# EAGLE design internal_board_OBC_ADCS_ver5_1 (EAGLE 9.0.1)
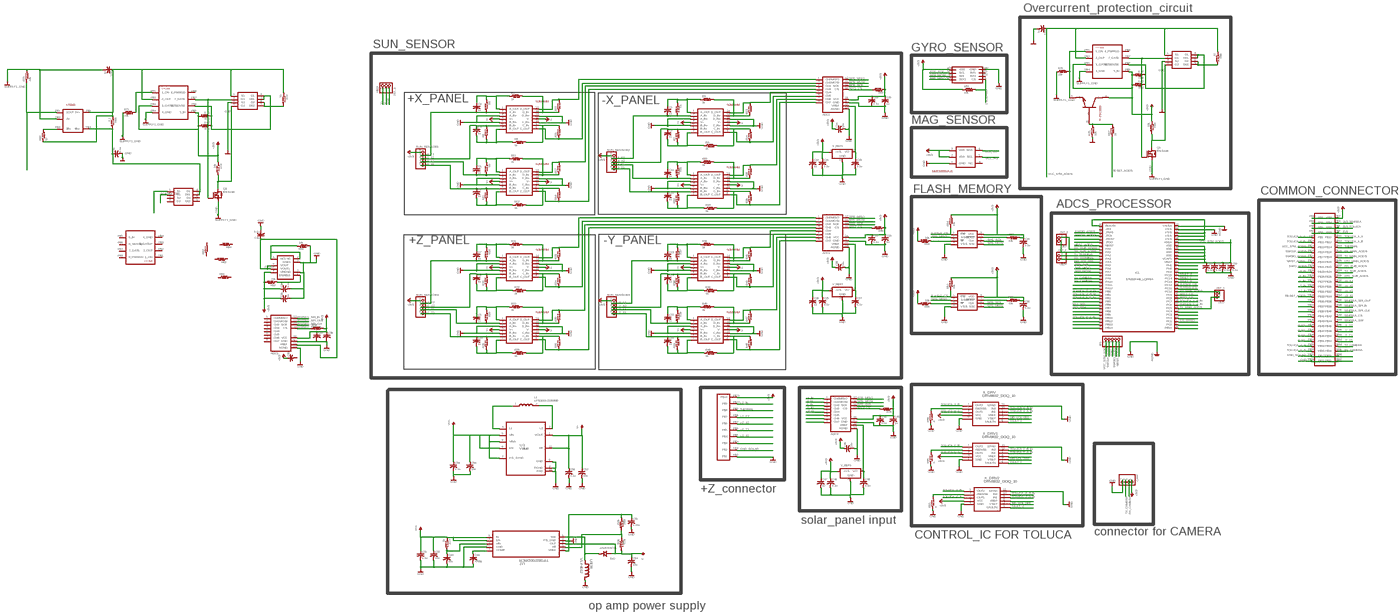
[diagram p0: schematic, sheet 1, overview]
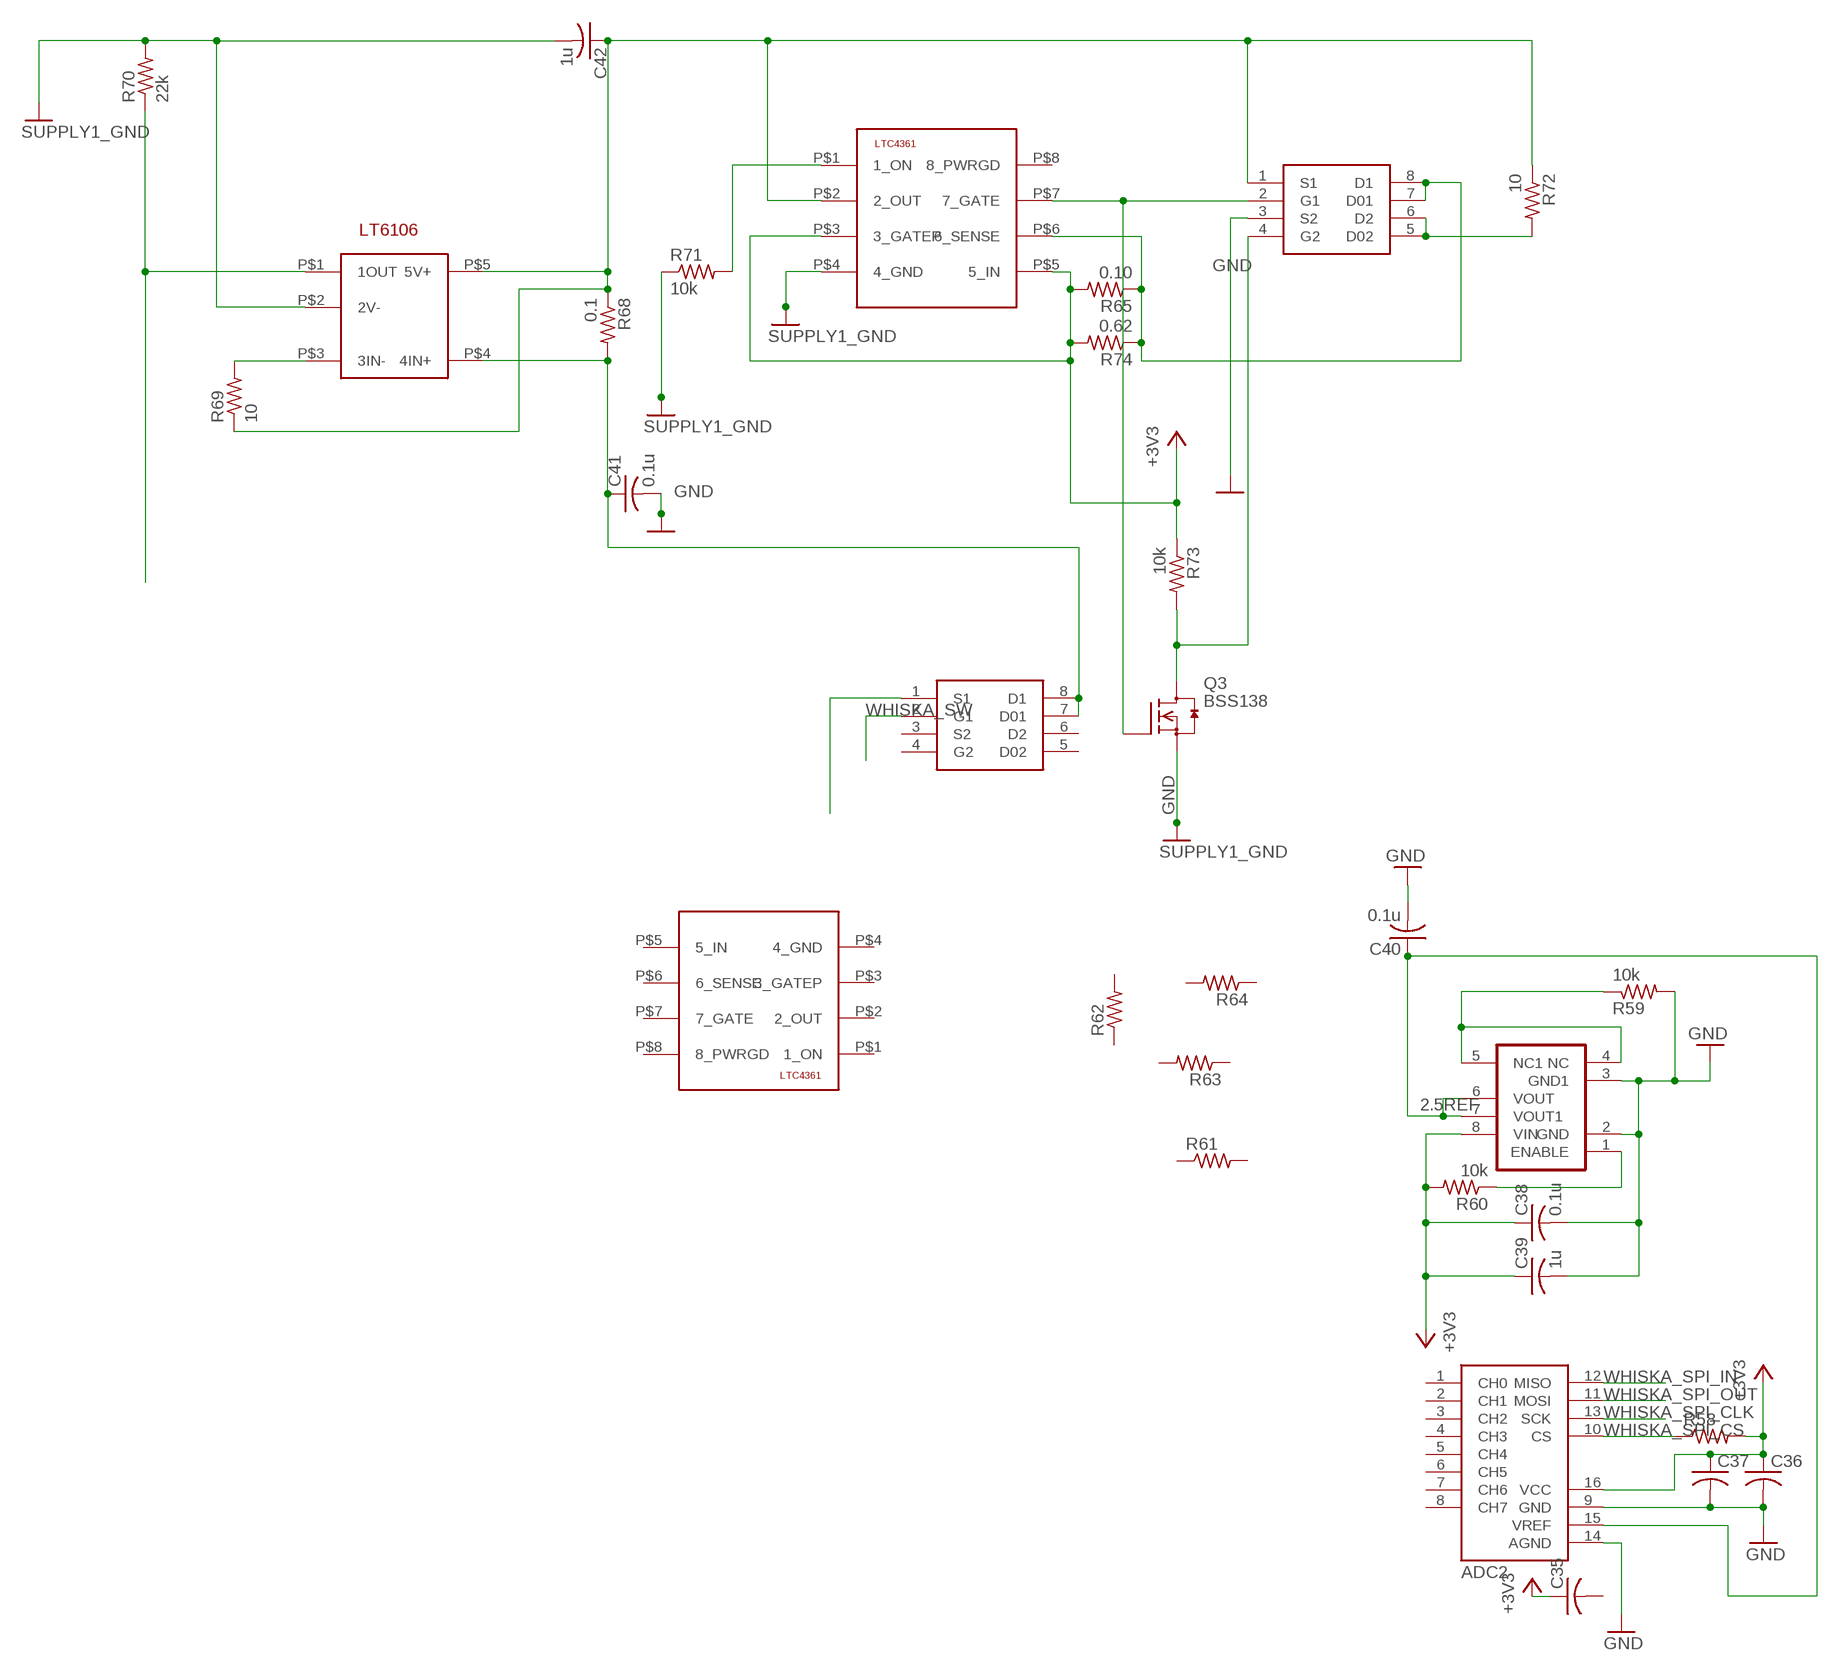
[diagram p1: schematic, sheet 1, part 1 of 4]
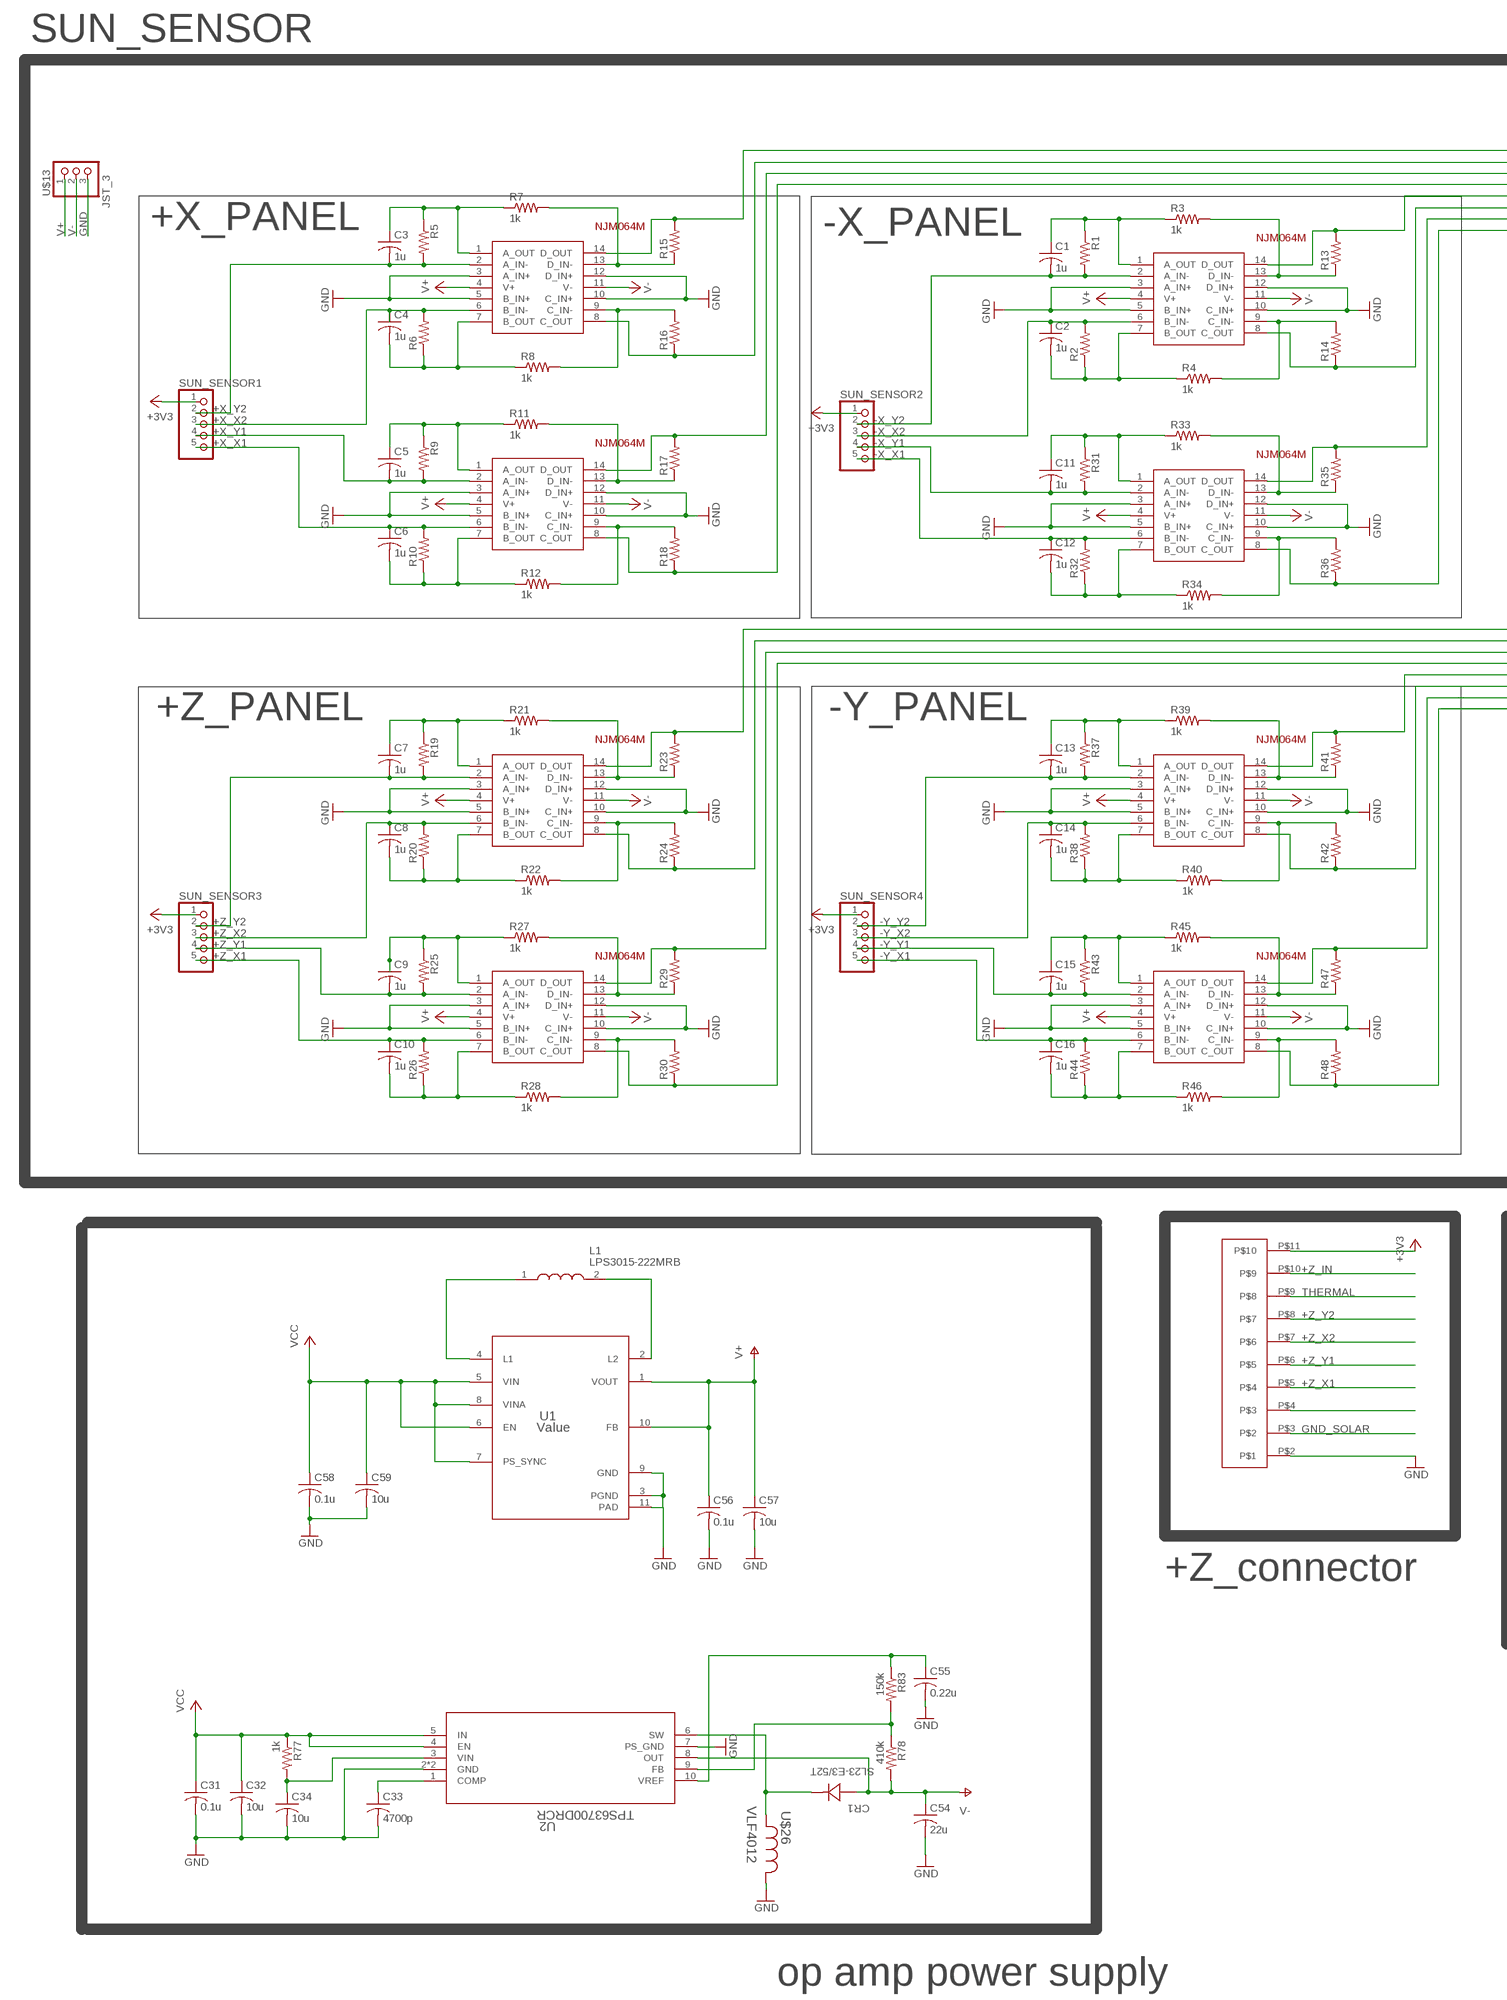
[diagram p2: schematic, sheet 1, part 2 of 4]
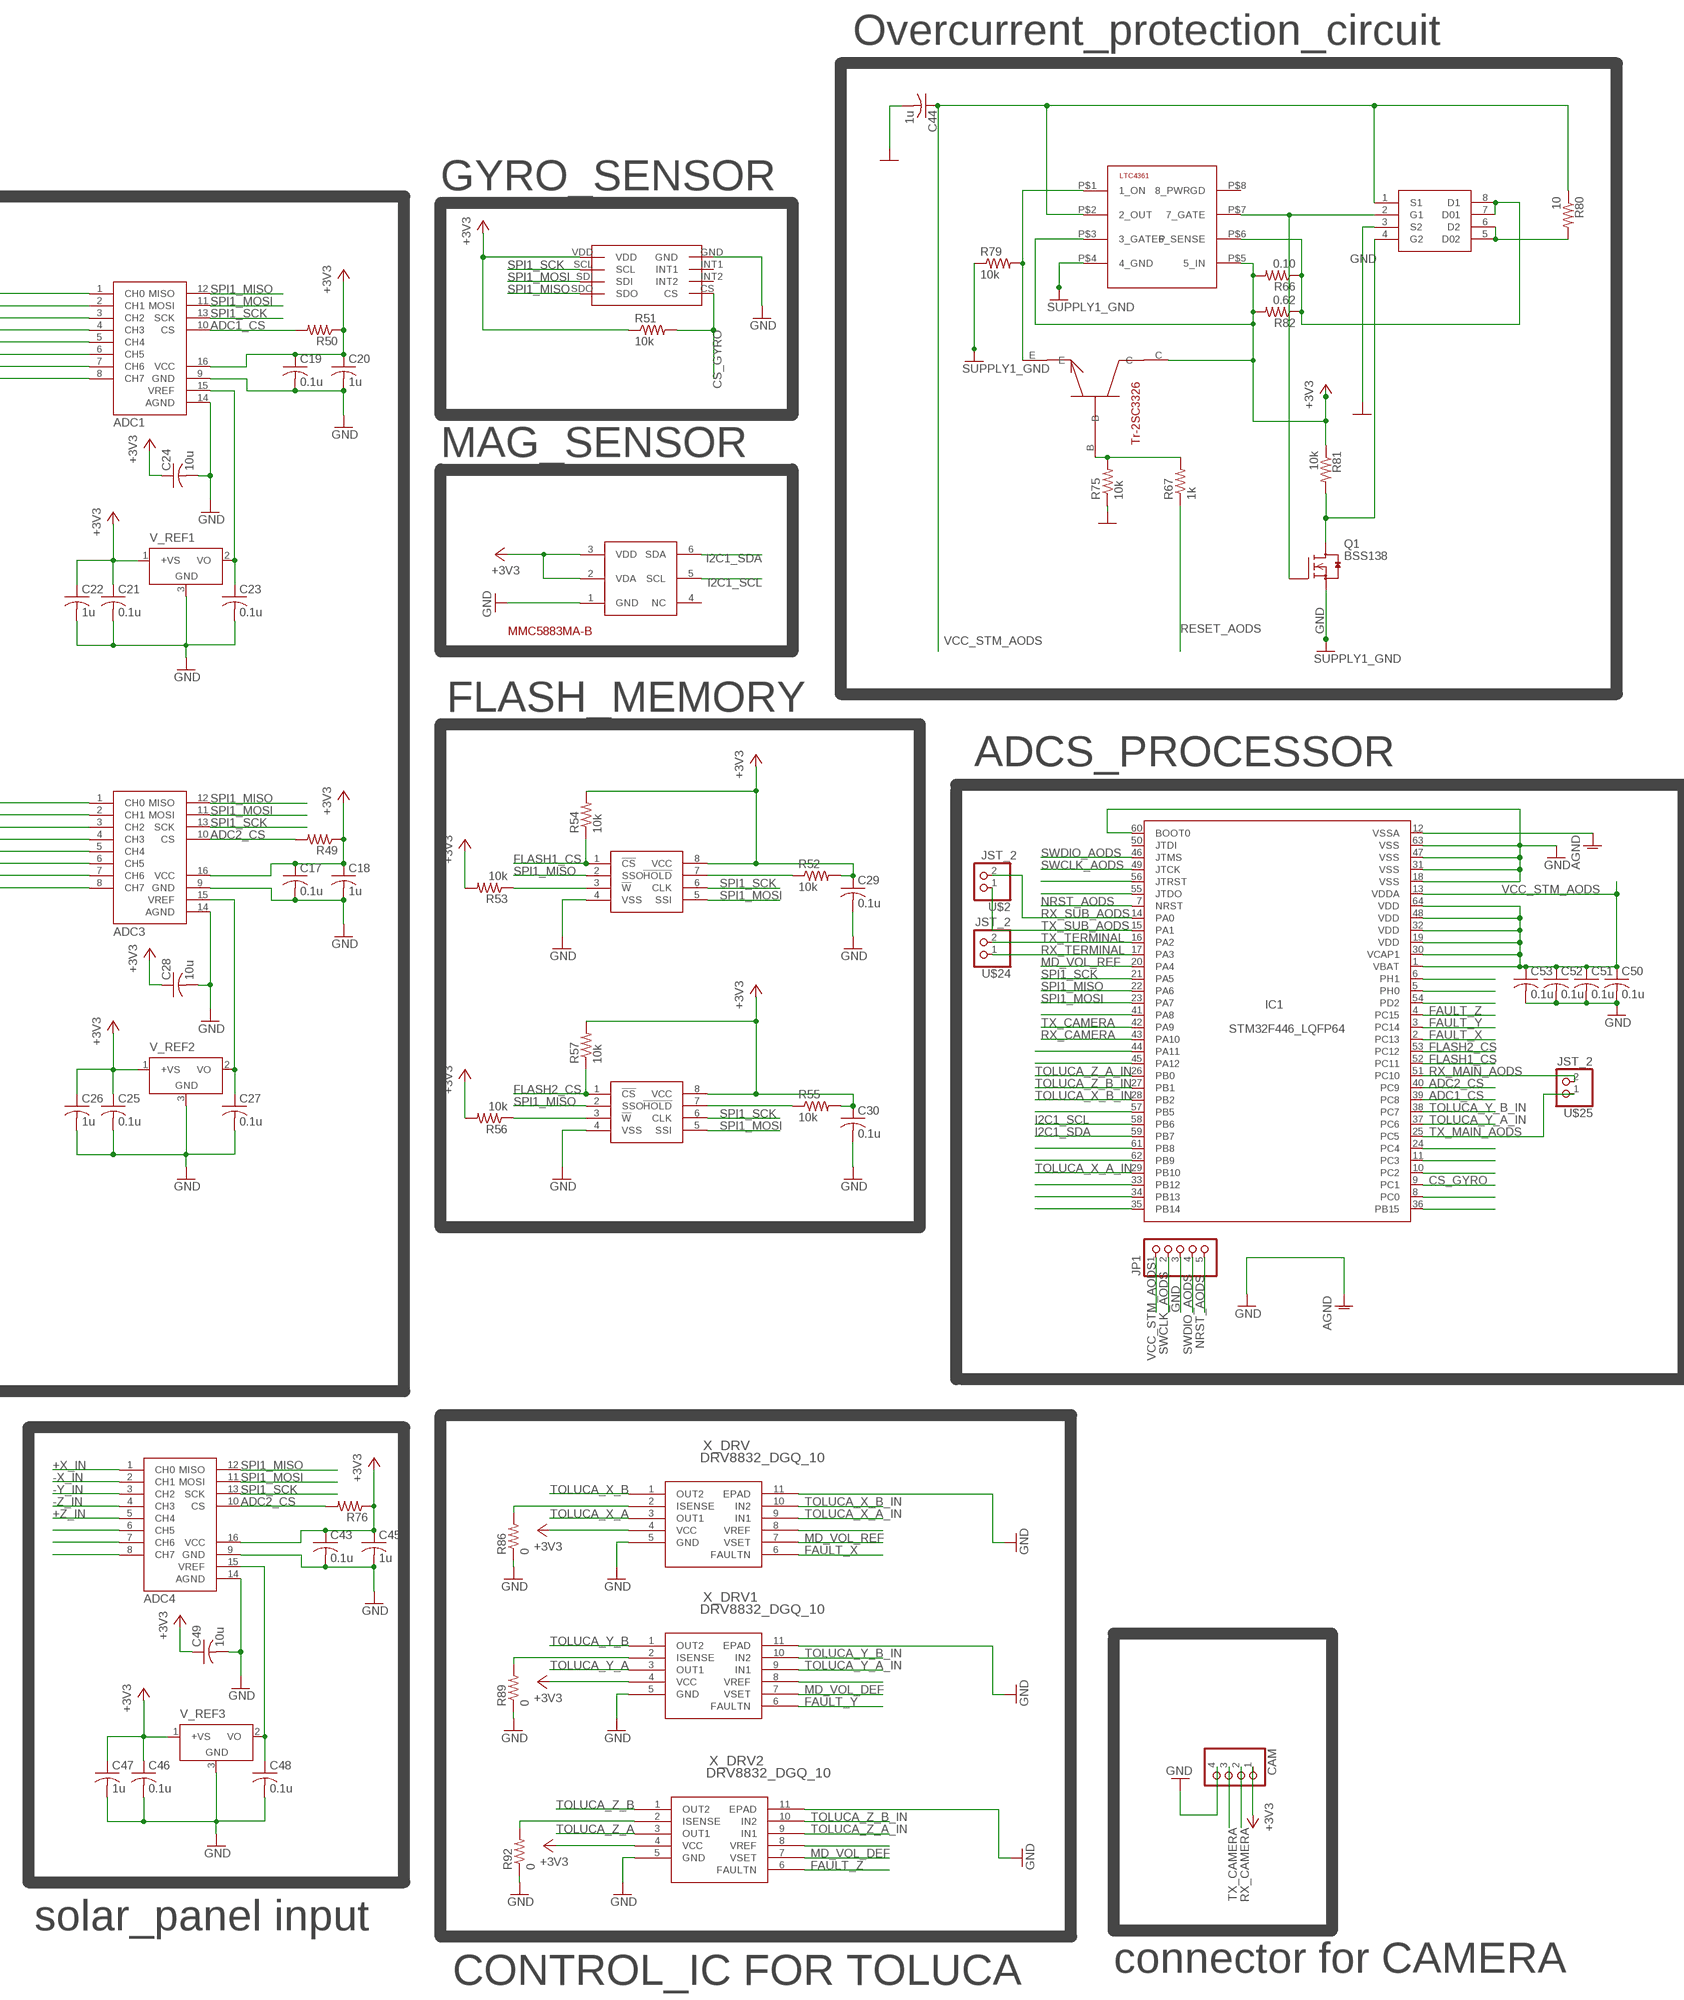
[diagram p3: schematic, sheet 1, part 3 of 4]
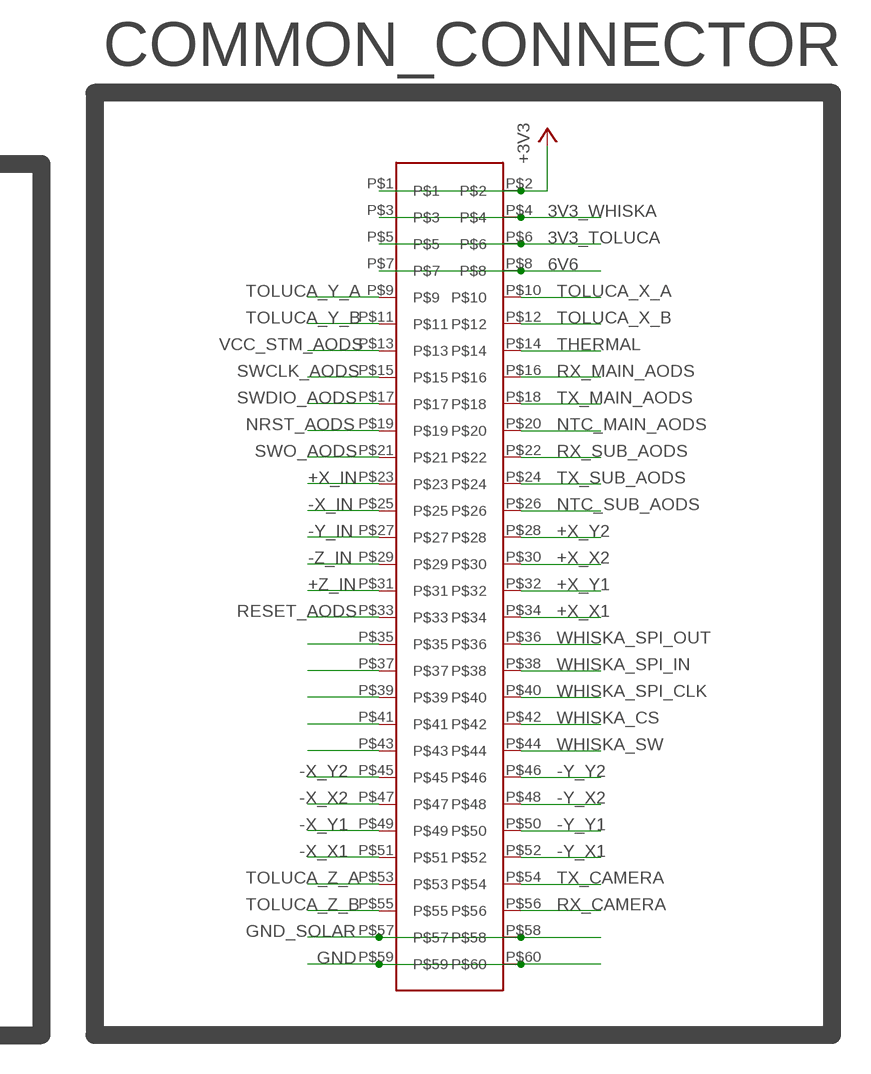
[diagram p4: schematic, sheet 1, part 4 of 4]

## Parts
ADC1  ADC_MCP3208  [SO16]
ADC2  ADC_MCP3208  [SO16]
ADC3  ADC_MCP3208  [SO16]
ADC4  ADC_MCP3208  [SO16]
C1  1u  C-USC2012  [C2012]
C2  1u  C-USC2012  [C2012]
C3  1u  C-USC2012  [C2012]
C4  1u  C-USC2012  [C2012]
C5  1u  C-USC2012  [C2012]
C6  1u  C-USC2012  [C2012]
C7  1u  C-USC2012  [C2012]
C8  1u  C-USC2012  [C2012]
C9  1u  C-USC2012  [C2012]
C10  1u  C-USC2012  [C2012]
C11  1u  C-USC2012  [C2012]
C12  1u  C-USC2012  [C2012]
C13  1u  C-USC2012  [C2012]
C14  1u  C-USC2012  [C2012]
C15  1u  C-USC2012  [C2012]
C16  1u  C-USC2012  [C2012]
C17  0.1u  C-USC2012  [C2012]
C18  1u  C-USC2012  [C2012]
C19  0.1u  C-USC2012  [C2012]
C20  1u  C-USC2012  [C2012]
C21  0.1u  C-USC2012  [C2012]
C22  1u  C-USC2012  [C2012]
C23  0.1u  C-USC2012  [C2012]
C24  10u  C-USC2012  [C2012]
C25  0.1u  C-USC2012  [C2012]
C26  1u  C-USC2012  [C2012]
C27  0.1u  C-USC2012  [C2012]
C28  10u  C-USC2012  [C2012]
C29  0.1u  C-USC2012  [C2012]
C30  0.1u  C-USC2012  [C2012]
C31  0.1u  C-USC2012  [C2012]
C32  10u  C-USC2012  [C2012]
C33  4700p  C-USC2012  [C2012]
C34  10u  C-USC2012  [C2012]
C35  C-USC2012  [C2012]
C36  C-USC2012  [C2012]
C37  C-USC2012  [C2012]
C38  0.1u  C-USC2012  [C2012]
C39  1u  C-USC2012  [C2012]
C40  0.1u  C-USC2012  [C2012]
C41  0.1u  C-USC2012  [C2012]
C42  1u  C-USC2012  [C2012]
C43  0.1u  C-USC2012  [C2012]
C44  1u  C-USC2012  [C2012]
C45  1u  C-USC2012  [C2012]
C46  0.1u  C-USC2012  [C2012]
C47  1u  C-USC2012  [C2012]
C48  0.1u  C-USC2012  [C2012]
C49  10u  C-USC2012  [C2012]
C50  0.1u  C-USC2012  [C2012]
C51  0.1u  C-USC2012  [C2012]
C52  0.1u  C-USC2012  [C2012]
C53  0.1u  C-USC2012  [C2012]
C54  22u  C-USC2012  [C2012]
C55  0.22u  C-USC2012  [C2012]
C56  0.1u  C-USC2012  [C2012]
C57  10u  C-USC2012  [C2012]
C58  0.1u  C-USC2012  [C2012]
C59  10u  C-USC2012  [C2012]
CAM  PINHD-1X4  [1X04]
CR1  SL23-E3/52T  [DIODE_DO214AA]
FLASH_CAM  MP25P80  [SO-08M]
FLASH_SENSOR  MP25P80  [SO-08M]
IC1  STM32F446_LQFP64  [LQFP64_PACKAGE]
JP1  PINHD-1X5  [1X05]
L1  LPS3015-222MRB  [LPS3015]
Q1  BSS138  [SOT23]
Q3  BSS138  [SOT23]
R1  R-US_R2012  [R2012]
R2  R-US_R2012  [R2012]
R3  1k  R-US_R2012  [R2012]
R4  1k  R-US_R2012  [R2012]
R5  R-US_R2012  [R2012]
R6  R-US_R2012  [R2012]
R7  1k  R-US_R2012  [R2012]
R8  1k  R-US_R2012  [R2012]
R9  R-US_R2012  [R2012]
R10  R-US_R2012  [R2012]
R11  1k  R-US_R2012  [R2012]
R12  1k  R-US_R2012  [R2012]
R13  R-US_R2012  [R2012]
R14  R-US_R2012  [R2012]
R15  R-US_R2012  [R2012]
R16  R-US_R2012  [R2012]
R17  R-US_R2012  [R2012]
R18  R-US_R2012  [R2012]
R19  R-US_R2012  [R2012]
R20  R-US_R2012  [R2012]
R21  1k  R-US_R2012  [R2012]
R22  1k  R-US_R2012  [R2012]
R23  R-US_R2012  [R2012]
R24  R-US_R2012  [R2012]
R25  R-US_R2012  [R2012]
R26  R-US_R2012  [R2012]
R27  1k  R-US_R2012  [R2012]
R28  1k  R-US_R2012  [R2012]
R29  R-US_R2012  [R2012]
R30  R-US_R2012  [R2012]
R31  R-US_R2012  [R2012]
R32  R-US_R2012  [R2012]
R33  1k  R-US_R2012  [R2012]
R34  1k  R-US_R2012  [R2012]
R35  R-US_R2012  [R2012]
R36  R-US_R2012  [R2012]
R37  R-US_R2012  [R2012]
R38  R-US_R2012  [R2012]
R39  1k  R-US_R2012  [R2012]
R40  1k  R-US_R2012  [R2012]
R41  R-US_R2012  [R2012]
R42  R-US_R2012  [R2012]
R43  R-US_R2012  [R2012]
R44  R-US_R2012  [R2012]
R45  1k  R-US_R2012  [R2012]
R46  1k  R-US_R2012  [R2012]
R47  R-US_R2012  [R2012]
R48  R-US_R2012  [R2012]
R49  R-US_R2012  [R2012]
R50  R-US_R2012  [R2012]
R51  10k  R-US_R2012  [R2012]
R52  10k  R-US_R2012  [R2012]
R53  10k  R-US_R2012  [R2012]
R54  10k  R-US_R2012  [R2012]
R55  10k  R-US_R2012  [R2012]
R56  10k  R-US_R2012  [R2012]
R57  10k  R-US_R2012  [R2012]
R58  R-US_R2012  [R2012]
R59  10k  R-US_R2012  [R2012]
R60  10k  R-US_R2012  [R2012]
R61  R-US_R2012  [R2012]
R62  R-US_R2012  [R2012]
R63  R-US_R2012  [R2012]
R64  R-US_R2012  [R2012]
R65  0.10  R-US_R2012  [R2012]
R66  0.10  R-US_R2012  [R2012]
R67  1k  R-US_R2012  [R2012]
R68  0.1  R-US_R2012  [R2012]
R69  10  R-US_R2012  [R2012]
R70  22k  R-US_R2012  [R2012]
R71  10k  R-US_R2012  [R2012]
R72  10  R-US_R2012  [R2012]
R73  10k  R-US_R2012  [R2012]
R74  0.62  R-US_R2012  [R2012]
R75  10k  R-US_R2012  [R2012]
R76  R-US_R2012  [R2012]
R77  1k  R-US_R2012  [R2012]
R78  410k  R-US_R2012  [R2012]
R79  10k  R-US_R2012  [R2012]
R80  10  R-US_R2012  [R2012]
R81  10k  R-US_R2012  [R2012]
R82  0.62  R-US_R2012  [R2012]
R83  150k  R-US_R2012  [R2012]
R86  0  R-US_R2012  [R2012]
R89  0  R-US_R2012  [R2012]
R92  0  R-US_R2012  [R2012]
SUN_SENSOR1  PINHD-1X5  [1X05]
SUN_SENSOR2  PINHD-1X5  [1X05]
SUN_SENSOR3  PINHD-1X5  [1X05]
SUN_SENSOR4  PINHD-1X5  [1X05]
U1  Value  TPS63000DRCR  [DRC0010A]
U2  TPS63700DRCR  [DRC10_2P4X1P65]
U$1  1.27_60  [1.27_60]
U$2  JST_2  [JST_2]
U$3  MMC5883MA-B  [MMC5883MA-B]
U$4  L3GD20_SET  [L3GD20_SET]
U$5  NJM064M  [NJM064M]
U$6  NJM064M  [NJM064M]
U$7  NJM064M  [NJM064M]
U$8  NJM064M  [NJM064M]
U$9  NJM064M  [NJM064M]
U$10  NJM064M  [NJM064M]
U$11  NJM064M  [NJM064M]
U$12  NJM064M  [NJM064M]
U$13  JST_3  [JST_3]
U$14  ADR3525  [ADR3525]
U$15  LTC4361  [LTC4361_2]
U$16  IRF7910  [SO-08]
U$17  LTC4361  [LTC4361_2]
U$18  LT6106  [LT6106]
U$19  IRF7910  [SO-08]
U$20  TR-NPN-2SC3326  [TR-NPN-2SC3326]
U$21  JST_1MM_10  [JST_1MM_10]
U$22  IRF7910  [SO-08]
U$23  LTC4361  [LTC4361_2]
U$24  JST_2  [JST_2]
U$25  JST_2  [JST_2]
U$26  VLF4012  [IND_4012]
V_REF1  LM50  [SOT23]
V_REF2  LM50  [SOT23]
V_REF3  LM50  [SOT23]
X_DRV  DRV8832_DGQ_10  [DGQ10_2P18X1P72]
X_DRV1  DRV8832_DGQ_10  [DGQ10_2P18X1P72]
X_DRV2  DRV8832_DGQ_10  [DGQ10_2P18X1P72]

## Nets
2.5REF: ADC2.15(VREF) C40.1 U$14.6(VOUT) U$14.7(VOUT1)
3V3_TOLUCA: U$1.P$5 U$1.P$6
3V3_WHISKA: U$1.P$3 U$1.P$4
6V6: U$1.P$7 U$1.P$8
+3V3: ADC1.16(VCC) ADC2.16(VCC) ADC3.16(VCC) ADC4.16(VCC) C17.1 C18.1 C19.1 C20.1 C21.1 C22.1 C24.1 C25.1 C26.1 C28.1 C29.1 C30.1 C35.1 C36.1 C37.1 C38.1 C39.1 C43.1 C45.1 C46.1 C47.1 C49.1 CAM.1 FLASH_CAM.8(VCC) FLASH_SENSOR.8(VCC) R49.1 R50.1 R51.1 R52.2 R53.2 R54.2 R55.2 R56.2 R57.2 R58.2 R60.2 R65.2 R66.2 R73.1 R74.2 R76.1 R81.1 R82.2 SUN_SENSOR1.1 SUN_SENSOR2.1 SUN_SENSOR3.1 SUN_SENSOR4.1 U$1.P$1 U$1.P$2 U$3.2(VDA) U$3.3(VDD) U$4.VDD U$14.8(VIN) U$15.P$3(3_GATEP) U$15.P$5(5_IN) U$17.P$3(3_GATEP) U$17.P$5(5_IN) U$20.C U$21.P$11 V_REF1.1(+VS) V_REF2.1(+VS) V_REF3.1(+VS) X_DRV1.4(VCC) X_DRV2.4(VCC) X_DRV.4(VCC)
+X_IN: ADC4.1(CH0) U$1.P$23
+X_X1: C6.1 R10.2 SUN_SENSOR1.5 U$1.P$34 U$7.6(B_IN-)
+X_X2: C4.1 R6.2 SUN_SENSOR1.3 U$1.P$30 U$6.6(B_IN-)
+X_Y1: C5.2 R9.2 SUN_SENSOR1.4 U$1.P$32 U$7.2(A_IN-)
+X_Y2: C3.2 R5.2 SUN_SENSOR1.2 U$1.P$28 U$6.2(A_IN-)
+Z_IN: ADC4.5(CH4) U$1.P$31 U$21.P$10
+Z_X1: C10.1 R26.2 SUN_SENSOR3.5 U$9.6(B_IN-) U$21.P$5
+Z_X2: C8.1 R20.2 SUN_SENSOR3.3 U$8.6(B_IN-) U$21.P$7
+Z_Y1: C9.2 R25.2 SUN_SENSOR3.4 U$9.2(A_IN-) U$21.P$6
+Z_Y2: C7.2 R19.2 SUN_SENSOR3.2 U$8.2(A_IN-) U$21.P$8
-X_IN: ADC4.2(CH1) U$1.P$25
-X_X1: C12.1 R32.2 SUN_SENSOR2.5 U$1.P$51 U$10.6(B_IN-)
-X_X2: C2.1 R2.2 SUN_SENSOR2.3 U$1.P$47 U$5.6(B_IN-)
-X_Y1: C11.2 R31.2 SUN_SENSOR2.4 U$1.P$49 U$10.2(A_IN-)
-X_Y2: C1.2 R1.2 SUN_SENSOR2.2 U$1.P$45 U$5.2(A_IN-)
-Y_IN: ADC4.3(CH2) U$1.P$27
-Y_X1: C16.1 R44.2 SUN_SENSOR4.5 U$1.P$52 U$12.6(B_IN-)
-Y_X2: C14.1 R38.2 SUN_SENSOR4.3 U$1.P$48 U$11.6(B_IN-)
-Y_Y1: C15.2 R43.2 SUN_SENSOR4.4 U$1.P$50 U$12.2(A_IN-)
-Y_Y2: C13.2 R37.2 SUN_SENSOR4.2 U$1.P$46 U$11.2(A_IN-)
-Z_IN: ADC4.4(CH3) U$1.P$29
ADC1_CS: ADC1.10(CS) IC1.39(PC8) R50.2
ADC2_CS: ADC3.10(CS) ADC4.10(CS) IC1.40(PC9) R49.2 R76.2
AGND: IC1.12(VSSA)
CRT-18F: R70.1 U$18.P$1(1OUT)
CS_GYRO: IC1.9(PC1) R51.2 U$4.CS
FAULT_X: IC1.2(PC13) X_DRV.6(FAULTN)
FAULT_Y: IC1.3(PC14) X_DRV1.6(FAULTN)
FAULT_Z: IC1.4(PC15) X_DRV2.6(FAULTN)
FLASH1_CS: FLASH_SENSOR.1(!CS) IC1.52(PC11) R54.1
FLASH2_CS: FLASH_CAM.1(!CS) IC1.53(PC12) R57.1
GND: ADC1.9(GND) ADC1.14(AGND) ADC2.9(GND) ADC2.14(AGND) ADC3.9(GND) ADC3.14(AGND) ADC4.9(GND) ADC4.14(AGND) C17.2 C18.2 C19.2 C20.2 C21.2 C22.2 C23.2 C24.2 C25.2 C26.2 C27.2 C28.2 C29.2 C30.2 C31.2 C32.2 C33.2 C34.2 C36.2 C37.2 C38.2 C39.2 C40.2 C41.2 C42.2 C43.2 C44.2 C45.2 C46.2 C47.2 C48.2 C49.2 C50.2 C51.2 C52.2 C53.2 C54.2 C55.2 C56.2 C57.2 C58.2 C59.2 CAM.4 FLASH_CAM.4(VSS) FLASH_SENSOR.4(VSS) IC1.18(VSS) IC1.31(VSS) IC1.47(VSS) IC1.60(BOOT0) IC1.63(VSS) JP1.3 Q1.2(S) Q3.2(S) R59.2 R70.2 R71.1 R75.1 R79.1 R86.1 R89.1 R92.1 U1.3(PGND) U1.9(GND) U1.11(PAD) U2.2(GND) U2.7(PS_GND) U2.11(GND) U$1.P$59 U$1.P$60 U$3.1(GND) U$4.GND U$5.3(A_IN+) U$5.5(B_IN+) U$5.10(C_IN+) U$5.12(D_IN+) U$6.3(A_IN+) U$6.5(B_IN+) U$6.10(C_IN+) U$6.12(D_IN+) U$7.3(A_IN+) U$7.5(B_IN+) U$7.10(C_IN+) U$7.12(D_IN+) U$8.3(A_IN+) U$8.5(B_IN+) U$8.10(C_IN+) U$8.12(D_IN+) U$9.3(A_IN+) U$9.5(B_IN+) U$9.10(C_IN+) U$9.12(D_IN+) U$10.3(A_IN+) U$10.5(B_IN+) U$10.10(C_IN+) U$10.12(D_IN+) U$11.3(A_IN+) U$11.5(B_IN+) U$11.10(C_IN+) U$11.12(D_IN+) U$12.3(A_IN+) U$12.5(B_IN+) U$12.10(C_IN+) U$12.12(D_IN+) U$13.3 U$14.2(GND) U$14.3(GND1) U$15.P$4(4_GND) U$16.3(S2) U$17.P$4(4_GND) U$18.P$2(2V-) U$19.3(S2) U$21.P$2 U$26.1 V_REF1.3(GND) V_REF2.3(GND) V_REF3.3(GND) X_DRV1.5(GND) X_DRV1.11(EPAD) X_DRV2.5(GND) X_DRV2.11(EPAD) X_DRV.5(GND) X_DRV.11(EPAD) ; supply symbol labelled AGND, SUPPLY1_GND
GND_SOLAR: U$1.P$57 U$1.P$58 U$21.P$3
I2C1_SCL: IC1.58(PB6) U$3.5(SCL)
I2C1_SDA: IC1.59(PB7) U$3.6(SDA)
MD_VOL_DEF: X_DRV1.7(VSET) X_DRV2.7(VSET)
MD_VOL_REF: IC1.20(PA4) X_DRV.7(VSET)
N$1: C4.2 R6.1 R8.1 U$6.7(B_OUT)
N$2: ADC1.1(CH0) R15.2 U$6.14(D_OUT)
N$3: ADC1.2(CH1) R16.1 U$6.8(C_OUT)
N$4: ADC1.6(CH5) R14.1 U$5.8(C_OUT)
N$5: R8.2 R16.2 U$6.9(C_IN-)
N$6: ADC1.7(CH6) R35.2 U$10.14(D_OUT)
N$7: ADC1.8(CH7) R36.1 U$10.8(C_OUT)
N$8: ADC1.5(CH4) R13.2 U$5.14(D_OUT)
N$9: ADC3.1(CH0) R23.2 U$8.14(D_OUT)
N$10: C2.2 R2.1 R4.1 U$5.7(B_OUT)
N$11: R4.2 R14.2 U$5.9(C_IN-)
N$12: C8.2 R20.1 R22.1 U$8.7(B_OUT)
N$13: C1.1 R1.1 R3.1 U$5.1(A_OUT)
N$14: R3.2 R13.1 U$5.13(D_IN-)
N$15: C33.1 U2.1(COMP)
N$16: C3.1 R5.1 R7.1 U$6.1(A_OUT)
N$17: R7.2 R15.1 U$6.13(D_IN-)
N$18: IC1.56(JTRST)
N$19: IC1.55(JTDO)
N$20: U$21.P$4
N$21: C6.2 R10.1 R12.1 U$7.7(B_OUT)
N$22: R12.2 R18.2 U$7.9(C_IN-)
N$23: C5.1 R9.1 R11.1 U$7.1(A_OUT)
N$24: R11.2 R17.1 U$7.13(D_IN-)
N$25: U$22.1(S1)
N$26: IC1.41(PA8)
N$27: ADC1.15(VREF) C23.1 V_REF1.2(VO)
N$28: ADC1.4(CH3) R18.1 U$7.8(C_OUT)
N$29: C12.2 R32.1 R34.1 U$10.7(B_OUT)
N$30: ADC1.3(CH2) R17.2 U$7.14(D_OUT)
N$31: R22.2 R24.2 U$8.9(C_IN-)
N$32: C7.1 R19.1 R21.1 U$8.1(A_OUT)
N$33: R21.2 R23.1 U$8.13(D_IN-)
N$34: IC1.44(PA11)
N$35: IC1.45(PA12)
N$36: C10.2 R26.1 R28.1 U$9.7(B_OUT)
N$37: R28.2 R30.2 U$9.9(C_IN-)
N$38: C9.1 R25.1 R27.1 U$9.1(A_OUT)
N$39: R27.2 R29.1 U$9.13(D_IN-)
N$40: C55.1 R83.1 U2.10(VREF)
N$41: C34.1 R77.2 U2.3(VIN)
N$42: ADC3.3(CH2) R29.2 U$9.14(D_OUT)
N$43: ADC3.4(CH3) R30.1 U$9.8(C_OUT)
N$45: ADC3.2(CH1) R24.1 U$8.8(C_OUT)
N$46: R34.2 R36.2 U$10.9(C_IN-)
N$47: C11.1 R31.1 R33.1 U$10.1(A_OUT)
N$48: R33.2 R35.1 U$10.13(D_IN-)
N$49: ADC4.6(CH5)
N$50: ADC4.7(CH6)
N$51: X_DRV.8(VREF)
N$52: ADC3.15(VREF) C27.1 V_REF2.2(VO)
N$53: ADC3.5(CH4) R41.2 U$11.14(D_OUT)
N$54: ADC3.6(CH5) R42.1 U$11.8(C_OUT)
N$55: C14.2 R38.1 R40.1 U$11.7(B_OUT)
N$56: R40.2 R42.2 U$11.9(C_IN-)
N$57: C13.1 R37.1 R39.1 U$11.1(A_OUT)
N$58: R39.2 R41.1 U$11.13(D_IN-)
N$59: ADC4.8(CH7)
N$60: ADC4.15(VREF) C48.1 V_REF3.2(VO)
N$61: C16.2 R44.1 R46.1 U$12.7(B_OUT)
N$62: R46.2 R48.2 U$12.9(C_IN-)
N$63: C15.1 R43.1 R45.1 U$12.1(A_OUT)
N$64: R45.2 R47.1 U$12.13(D_IN-)
N$65: R78.1 R83.2 U2.9(FB)
N$66: CR1.1 U2.6(SW) U$26.2
N$67: ADC3.7(CH6) R47.2 U$12.14(D_OUT)
N$68: ADC3.8(CH7) R48.1 U$12.8(C_OUT)
N$69: R65.1 R74.1 U$15.P$6(6_SENSE) U$16.7(D01) U$16.8(D1)
N$70: FLASH_SENSOR.3(!W) R53.1
N$71: FLASH_CAM.7(!HOLD) R55.1
N$72: Q3.1(G) U$15.P$7(7_GATE) U$16.2(G1)
N$73: FLASH_CAM.3(!W) R56.1
N$74: FLASH_SENSOR.7(!HOLD) R52.1
N$75: C42.1 R68.1 R69.1 R72.1 U$15.P$2(2_OUT) U$16.1(S1) U$18.P$5(5V+)
N$76: IC1.5(PH0)
N$77: IC1.6(PH1)
N$78: R89.2 X_DRV1.2(ISENSE)
N$80: L1.1 U1.4(L1)
N$81: L1.2 U1.2(L2)
N$82: X_DRV2.8(VREF)
N$83: IC1.10(PC2)
N$84: IC1.11(PC3)
N$85: IC1.24(PC4)
N$86: R59.1 U$14.4(NC) U$14.5(NC1)
N$87: R60.1 U$14.1(ENABLE)
N$88: IC1.8(PC0)
N$89: IC1.36(PB15)
N$90: IC1.33(PB12)
N$91: R71.2 U$15.P$1(1_ON)
N$92: C41.1 R68.2 U$18.P$4(4IN+) U$22.7(D01) U$22.8(D1)
N$93: R69.2 U$18.P$3(3IN-)
N$94: R72.2 U$16.5(D02) U$16.6(D2)
N$95: Q3.3(D) R73.2 U$16.4(G2)
N$96: R66.1 R82.1 U$17.P$6(6_SENSE) U$19.7(D01) U$19.8(D1)
N$97: Q1.1(G) U$17.P$7(7_GATE) U$19.2(G1)
N$98: IC1.34(PB13)
N$99: R79.2 U$17.P$1(1_ON) U$20.E
N$100: R67.2 R75.2 U$20.B
N$101: IC1.35(PB14)
N$102: R80.2 U$19.5(D02) U$19.6(D2)
N$103: Q1.3(D) R81.2 U$19.4(G2)
N$104: IC1.54(PD2)
N$105: IC1.57(PB5)
N$106: U$1.P$35
N$107: U$1.P$37
N$108: U$1.P$39
N$109: U$1.P$41
N$110: U$1.P$43
N$111: IC1.61(PB8)
N$112: IC1.62(PB9)
N$113: R92.2 X_DRV2.2(ISENSE)
N$115: X_DRV1.8(VREF)
N$118: R86.2 X_DRV.2(ISENSE)
NRST_AODS: IC1.7(NRST) JP1.5 U$1.P$19
NTC_MAIN_AODS: U$1.P$20
NTC_SUB_AODS: U$1.P$26
RESET_AODS: R67.1 U$1.P$33
RX_CAMERA: CAM.2 IC1.43(PA10) U$1.P$56
RX_MAIN_AODS: IC1.51(PC10) U$1.P$16 U$25.2
RX_SUB_AODS: IC1.14(PA0) U$1.P$22 U$2.2
RX_TERMINAL: IC1.17(PA3) U$24.1
SPI1_MISO: ADC1.12(MISO) ADC3.12(MISO) ADC4.12(MISO) FLASH_CAM.2(SSO) FLASH_SENSOR.2(SSO) IC1.22(PA6) U$4.SDO
SPI1_MOSI: ADC1.11(MOSI) ADC3.11(MOSI) ADC4.11(MOSI) FLASH_CAM.5(SSI) FLASH_SENSOR.5(SSI) IC1.23(PA7) U$4.SDI
SPI1_SCK: ADC1.13(SCK) ADC3.13(SCK) ADC4.13(SCK) FLASH_CAM.6(CLK) FLASH_SENSOR.6(CLK) IC1.21(PA5) U$4.SCL
SWCLK_AODS: IC1.49(JTCK) JP1.2 U$1.P$15
SWDIO_AODS: IC1.46(JTMS) JP1.4 U$1.P$17
SWO_AODS: U$1.P$21
THERMAL: U$1.P$14 U$21.P$9
TOLUCA_X_A: U$1.P$10 X_DRV.3(OUT1)
TOLUCA_X_A_IN: IC1.29(PB10) X_DRV.9(IN1)
TOLUCA_X_B: U$1.P$12 X_DRV.1(OUT2)
TOLUCA_X_B_IN: IC1.28(PB2) X_DRV.10(IN2)
TOLUCA_Y_A: U$1.P$9 X_DRV1.3(OUT1)
TOLUCA_Y_A_IN: IC1.37(PC6) X_DRV1.9(IN1)
TOLUCA_Y_B: U$1.P$11 X_DRV1.1(OUT2)
TOLUCA_Y_B_IN: IC1.38(PC7) X_DRV1.10(IN2)
TOLUCA_Z_A: U$1.P$53 X_DRV2.3(OUT1)
TOLUCA_Z_A_IN: IC1.26(PB0) X_DRV2.9(IN1)
TOLUCA_Z_B: U$1.P$55 X_DRV2.1(OUT2)
TOLUCA_Z_B_IN: IC1.27(PB1) X_DRV2.10(IN2)
TX_CAMERA: CAM.3 IC1.42(PA9) U$1.P$54
TX_MAIN_AODS: IC1.25(PC5) U$1.P$18 U$25.1
TX_SUB_AODS: IC1.15(PA1) U$1.P$24 U$2.1
TX_TERMINAL: IC1.16(PA2) U$24.2
V+: C56.1 C57.1 U1.1(VOUT) U1.10(FB) U$5.4(V+) U$6.4(V+) U$7.4(V+) U$8.4(V+) U$9.4(V+) U$10.4(V+) U$11.4(V+) U$12.4(V+) U$13.1
V-: C54.1 CR1.2 R78.2 U2.8(OUT) U$5.11(V-) U$6.11(V-) U$7.11(V-) U$8.11(V-) U$9.11(V-) U$10.11(V-) U$11.11(V-) U$12.11(V-) U$13.2
VCC: C31.1 C32.1 C58.1 C59.1 R77.1 U1.5(VIN) U1.6(EN) U1.7(PS_SYNC) U1.8(VINA) U2.4(EN) U2.5(IN)
VCC_STM_AODS: C44.1 C50.1 C51.1 C52.1 C53.1 IC1.1(VBAT) IC1.13(VDDA) IC1.19(VDD) IC1.30(VCAP1) IC1.32(VDD) IC1.48(VDD) IC1.64(VDD) JP1.1 R80.1 U$1.P$13 U$17.P$2(2_OUT) U$19.1(S1)
WHISKA_CS: U$1.P$42
WHISKA_SPI_CLK: ADC2.13(SCK) U$1.P$40
WHISKA_SPI_CS: ADC2.10(CS) R58.1
WHISKA_SPI_IN: ADC2.12(MISO) U$1.P$38
WHISKA_SPI_OUT: ADC2.11(MOSI) U$1.P$36
WHISKA_SW: U$1.P$44 U$22.2(G1)
Unconnected: ADC2.1(CH0) ADC2.2(CH1) ADC2.3(CH2) ADC2.4(CH3) ADC2.5(CH4) ADC2.6(CH5) ADC2.7(CH6) ADC2.8(CH7) C35.2 IC1.50(JTDI) R61.1 R61.2 R62.1 R62.2 R63.1 R63.2 R64.1 R64.2 U$3.4(NC) U$4.INT1 U$4.INT2 U$15.P$8(8_PWRGD) U$17.P$8(8_PWRGD) U$22.3(S2) U$22.5(D02) U$22.6(D2) U$23.P$1(1_ON) U$23.P$2(2_OUT) U$23.P$3(3_GATEP) U$23.P$4(4_GND) U$23.P$5(5_IN) U$23.P$6(6_SENSE) U$23.P$7(7_GATE) U$23.P$8(8_PWRGD)

## Notes on the sheet
- Overcurrent_protection_circuit
- SUN_SENSOR | GYRO_SENSOR
- +X_PANEL | -X_PANEL
- MAG_SENSOR
- FLASH_MEMORY | COMMON_CONNECTOR
- ADCS_PROCESSOR
- +Z_PANEL | -Y_PANEL
- +Z_connector
- solar_panel input
- CONTROL_IC FOR TOLUCA | connector for CAMERA
- op amp power supply

## Power pins joined to a net without a drawn wire
G2: U$22.4(G2)

## Library data of the parts
ADC1-ADC4 = aoba01:ADC_MCP3208: MicroChip 12bit 8ch A/D converter
C1-C37 C43 C45-C59 = rcl:C-US: CAPACITOR, American symbol; SPICEPREFIX: C
C38-C42 C44 = resistor:C-US: CAPACITOR, American symbol
CAM = pinhead:PINHD-1X4: PIN HEADER
CR1 = SL23-E3:SL23-E3/52T; MANUFACTURER_PART_NUMBER: SL23E352T; VENDOR: Vishay
FLASH_CAM FLASH_SENSOR = aoba01:MP25P80: flashmemory
IC1 = stm32f446re:STM32F446_LQFP64: STM32F446_LQFP64 edit this description Auto generated by make-symbol-device-package-bsdl.ulp Rev. 44 Source: STM32F446_LQFP64.bsd
JP1 SUN_SENSOR1-SUN_SENSOR4 = pinhead:PINHD-1X5: PIN HEADER
L1 = SamacSys_Parts:LPS3015-222MRB: COILCRAFT - LPS3015-222MRB - INDUCTOR, SHLD, 2.2UH, 20%, 1.1A, SMD Source: Datasheet <https://componentsearchengine.com/Datasheets/1/LPS3015-222MRB.pdf>; DESCRIPTION: COILCRAFT - LPS3015-222MRB - INDUCTOR, SHLD, 2.2UH, 20%, 1.1A, SMD; HEIGHT: mm; MANUFACTURER_NAME: COILCRAFT; MANUFACTURER_PART_NUMBER: LPS3015-222MRB; MOUSER_PART_NUMBER: 994-LPS3015-222MRB; MOUSER_PRICE-STOCK: https://www.mouser.com/Search/Refine.aspx?Keyword=994-LPS3015-222MRB
Q1 Q3 = m-pad-2.1:BSS138: Fairchild Semiconductors BSS138 N-Channel Logic Level Enhancement Mode Field Effect Transistor General Description: These N-Channel enhancement mode field effect transistors are produced using Fairchild's proprietary, high cell density, DMOS technology. These products have been designed to minimize on-state resistance while provide rugged, reliable, and fast switching performance.These products are particularly suited for low voltage, low current applications such as small servo motor control, power MOSFET gate drivers, and other switching applications. Features: 0.22 A, 50 V. RDS(ON) = 3.5Ohm @ VGS = 10 V RDS(ON) = 6.0Ohm @ VGS = 4.5 V High density cell design for extremely low RDS(ON) Rugged and Reliable Compact industry standard SOT-23 surface mount package Please send any comments to: messi@users.sourceforge.net
R1-R58 R61-R64 R76-R78 R83 R86 R89 R92 = rcl:R-US_: RESISTOR, American symbol; SPICEPREFIX: R
R59 R60 R65-R75 R79-R82 = resistor:R-US_: RESISTOR, American symbol
U1 = TPS63000:TPS63000DRCR; COMPTYPE: IC; MANUFACTURER: Texas Instruments; MOUNTTYPE: SMT; PACKAGEREFERENCE: DRC0010A; PARTNUMBER: TPS63000DRC; PIN_COUNT: 11; REFDES: RefDes; ROHS: Y; TYPE: TYPE
U2 = TPS63700:TPS63700DRCR; MANUFACTURER_PART_NUMBER: TPS63700DRCR; VENDOR: Texas Instruments
U$1 = 1.27_2_60_pinhead:1.27_60
U$2 U$24 U$25 = JST01:JST_2
U$3 = MMC5883MA-B:MMC5883MA-B
U$4 = L3GD20_set:L3GD20_SET
U$5-U$12 = NJM064M:NJM064M
U$13 = JST01:JST_3
U$14 = aoba:ADR3525
U$15 U$17 U$23 = aoba:LTC4361
U$16 U$19 U$22 = aoba:IRF7910
U$18 = aoba:LT6106
U$20 = Kill-Sw:TR-NPN-2SC3326
U$21 = JST_1mm_5:JST_1MM_10
U$26 = VLF4012:VLF4012
V_REF1-V_REF3 = linear:LM50: SOT-23 Single-Supply Centigrade Temperature Sensor Vout = (10mV/°C x Temp °C) +5mmmV Source: http://cache.national.com/ds/LM/LM50.pdf
X_DRV X_DRV1 X_DRV2 = DRV8832_DGQ_10:DRV8832_DGQ_10; DATASHEETURL: httpwww.ti.comlitgpnDRV8832; FAMILY_NAME: BRUSHED DC DRIVER; GENERIC_PART_NUMBER: DRV8832; INDUSTRY_STD_PKG_TYPE: MSOPPowerPAD; MANUFACTURER: Texas Instruments; MANUFACTURER_PART_NUMBER: drv8832_dgq_10; PACKAGE_DESIGNATOR: DGQ; PIN_COUNT: 10; VENDOR: Texas Instruments

## Board
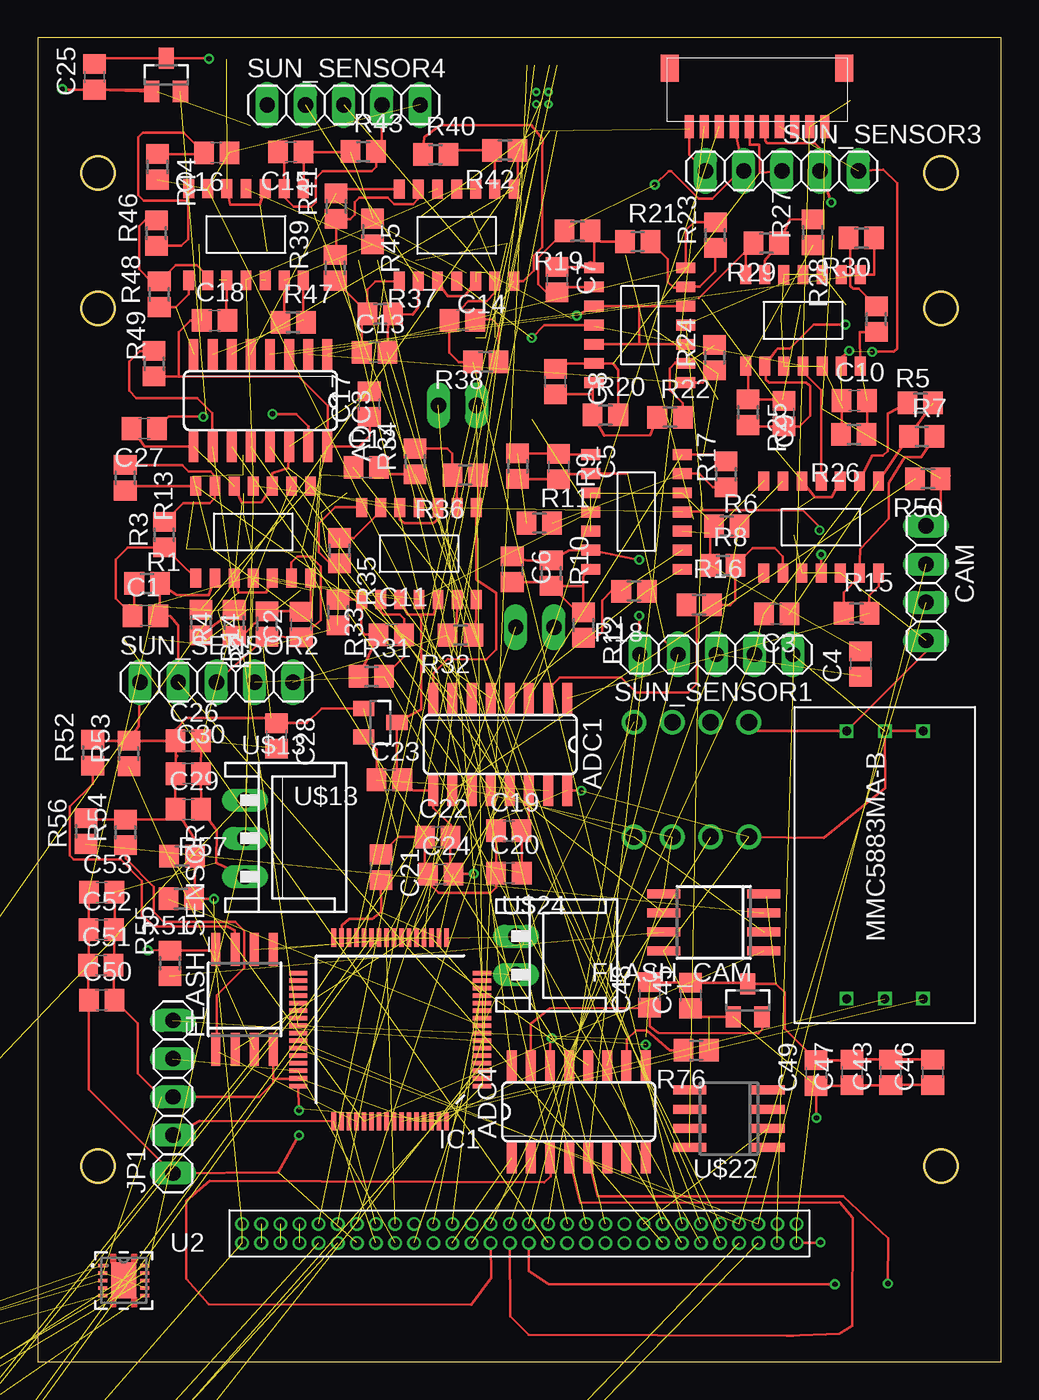
[diagram p5: board, top side]
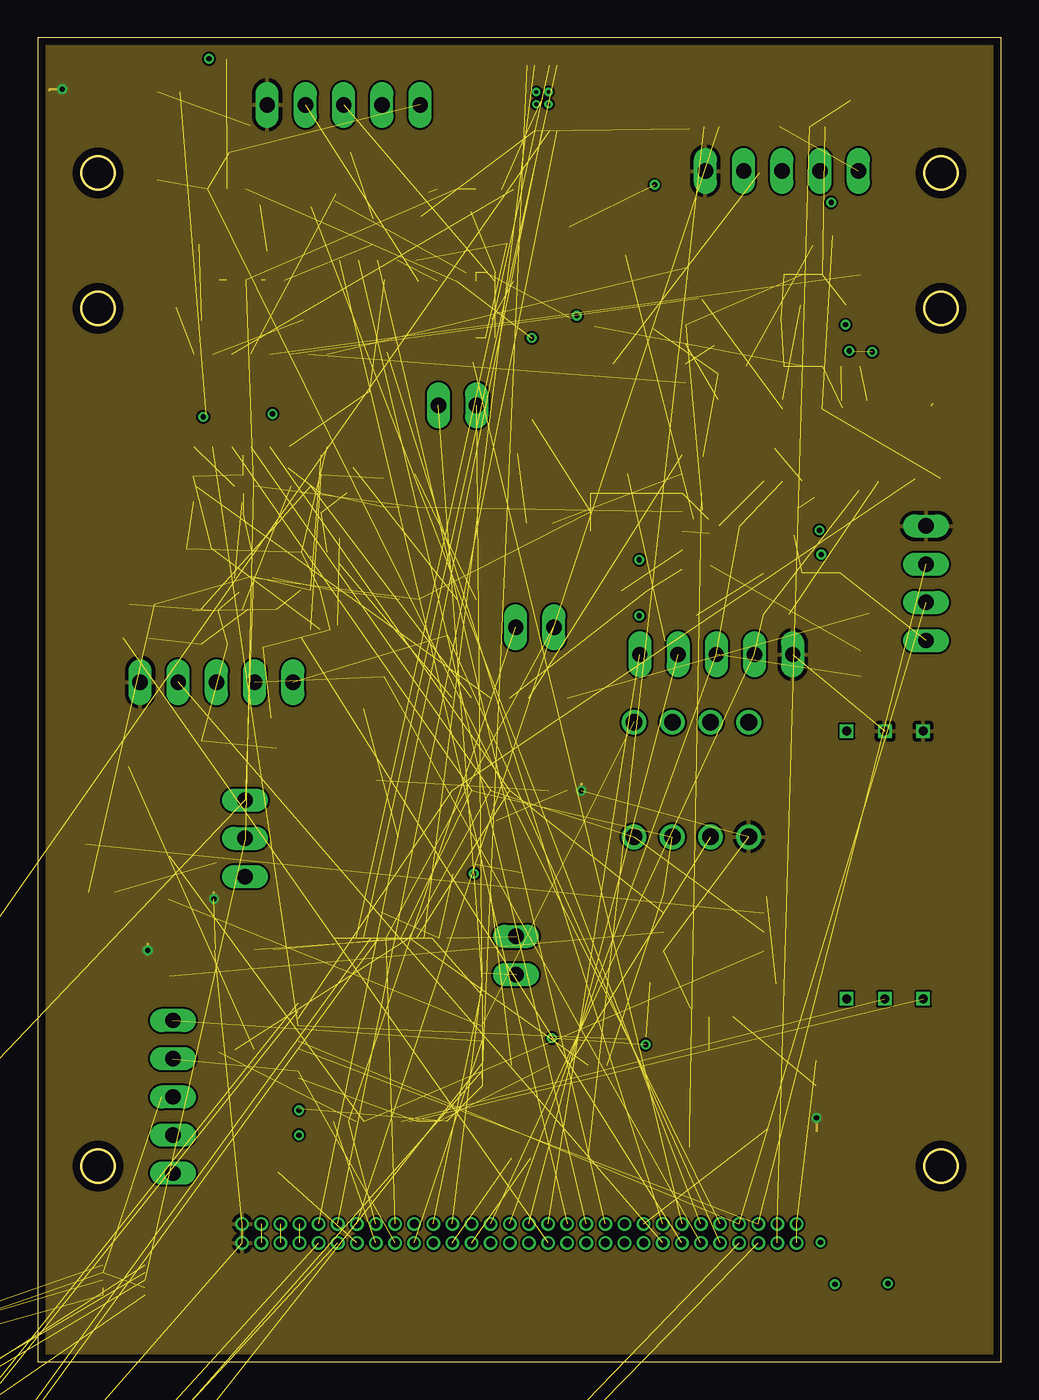
[diagram p6: board, inner layer Route2]
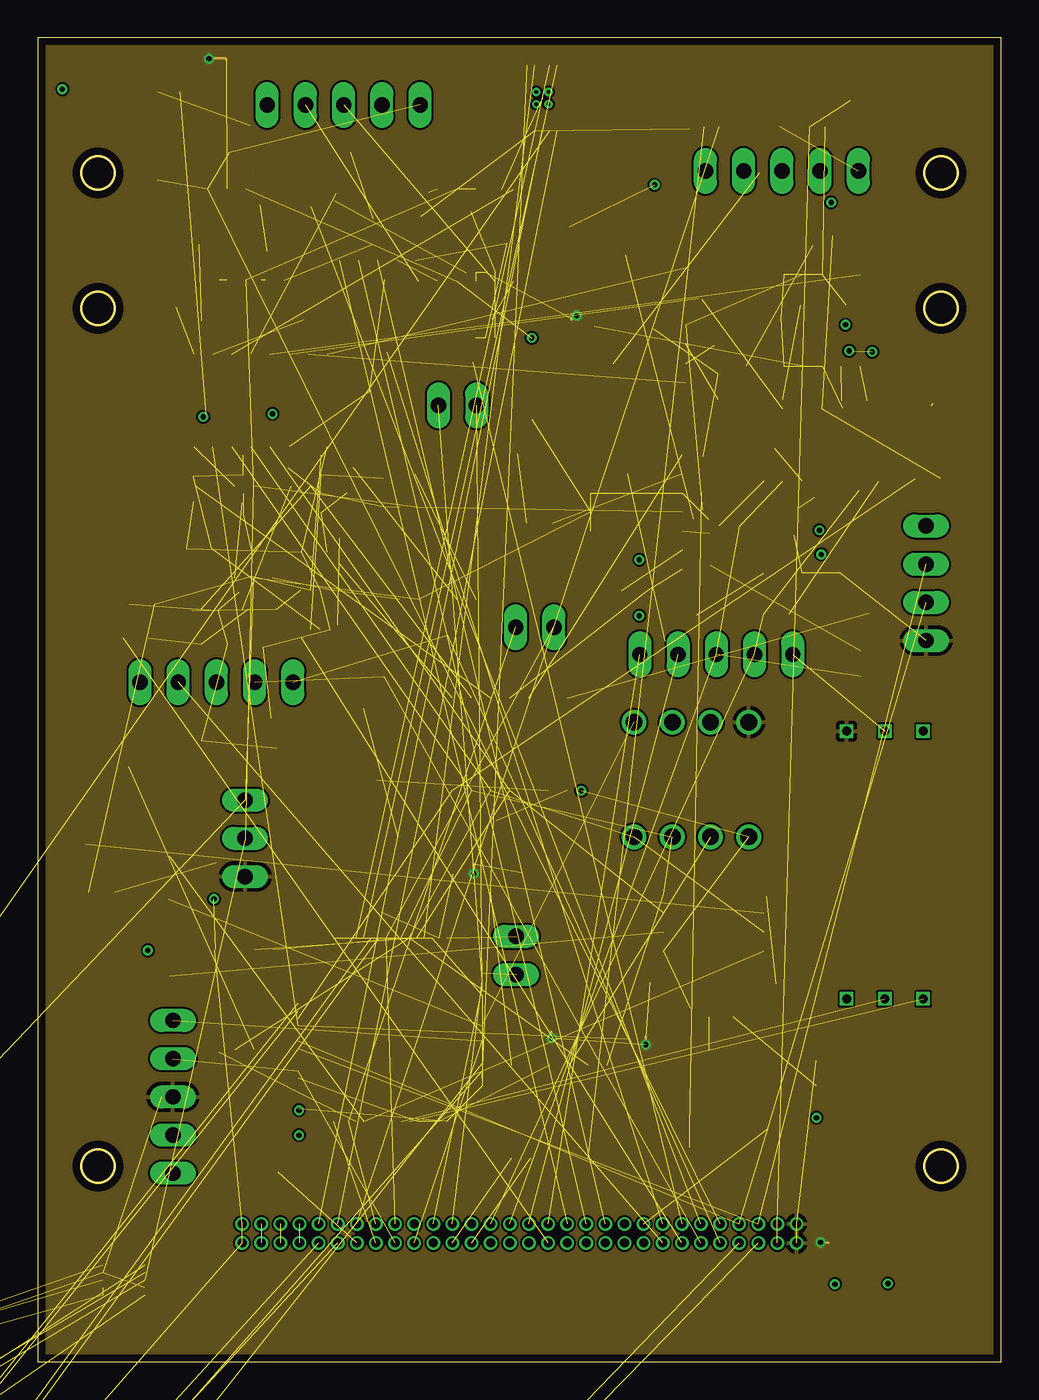
[diagram p7: board, inner layer Route15]
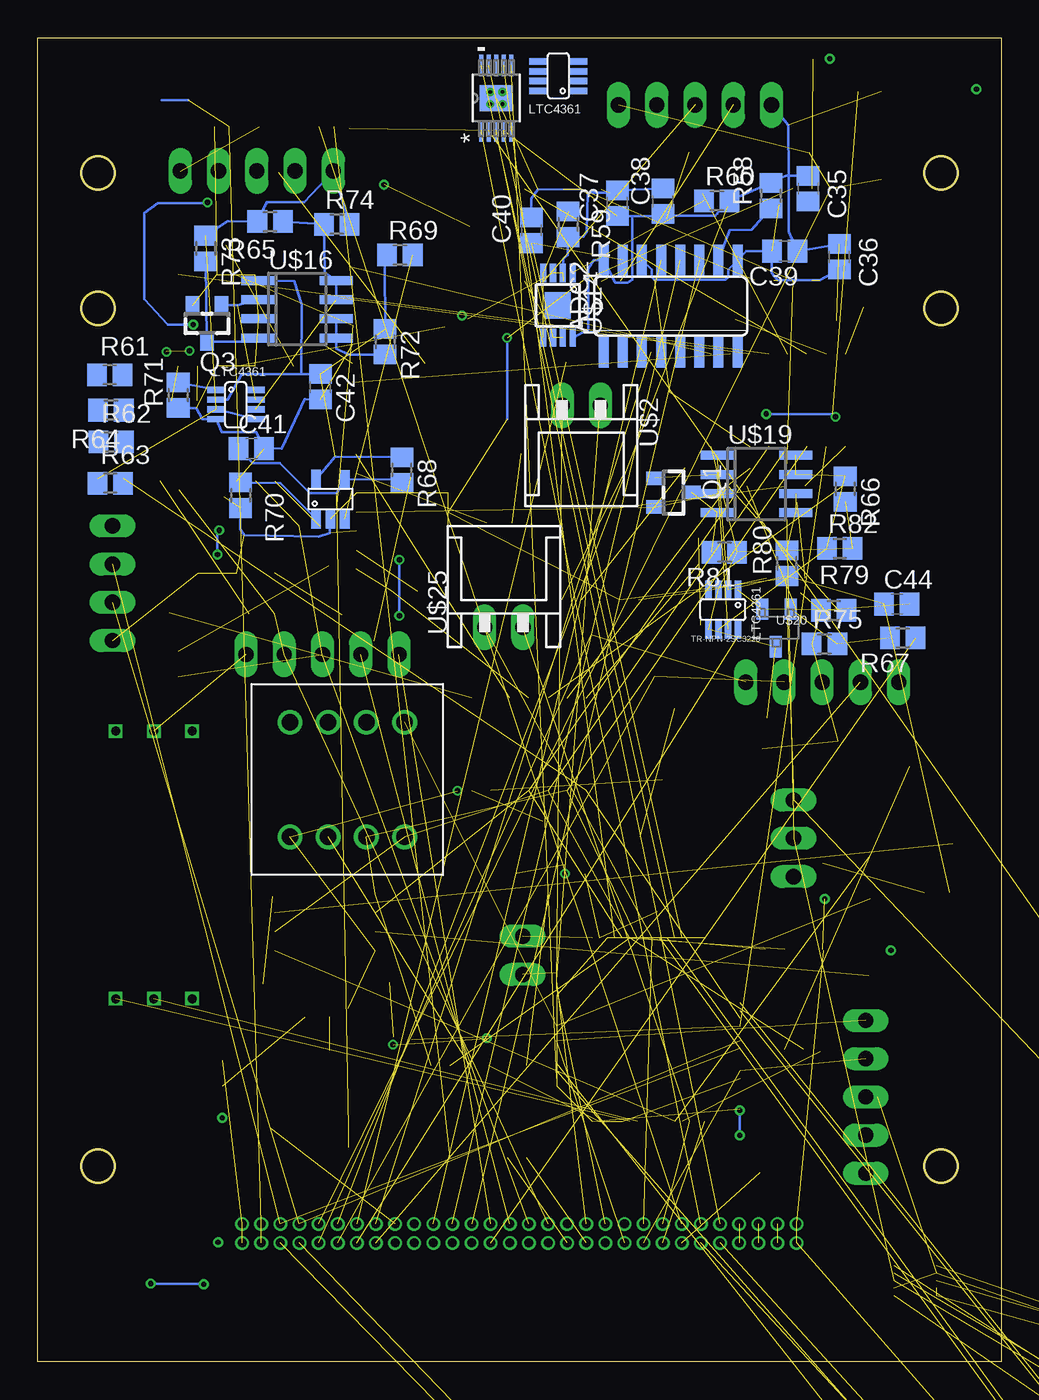
[diagram p8: board, bottom side, seen from below]

Size 64 x 88 mm. Coordinates in mm from the lower left corner, seen from the top.
Outline: 0,0 64,0 64,88 0,88 0,0
Outline: circle at 4,13 radius 1.1
Outline: circle at 60,13 radius 1.1
Outline: circle at 4,70 radius 1.1
Outline: circle at 4,79 radius 1.1
Outline: circle at 60,79 radius 1.1
Outline: circle at 60,70 radius 1.1
Copper layers (1+2*15+16): Top 0.018mm / dielectric 0.25mm / Route2 0.035mm / dielectric 1mm / Route15 0.035mm / dielectric 0.25mm / Bottom 0.018mm
Design rules "pban_5mil-l4": minimum track width 5mil, minimum drill 0.3mm, track to track 5mil, track to pad 0.229mm, pad to pad 5mil, via to via 5mil, smd to smd 5mil, copper to edge 0.5mm, drill to drill 0.5mm, minimum pad ring 0.15mm, minimum via ring 0.15mm, stop-mask expansion 4mil, vias tented up to drill 0.35mm, thermal gap 10mil

### Footprints (pad centres in the part's own frame; a part is rotated, then mirrored left to right if it is on the bottom)
SO16 = smd 0.66 x 2.032: 1 -4.445,-3.073; 2 -3.175,-3.073; 3 -1.905,-3.073; 4 -0.635,-3.073; 5 0.635,-3.073; 6 1.905,-3.073; 7 3.175,-3.073; 8 4.445,-3.073; 9 4.445,3.073; 10 3.175,3.073; 11 1.905,3.073; 12 0.635,3.073; 13 -0.635,3.073; 14 -1.905,3.073; 15 -3.175,3.073; 16 -4.445,3.073
C2012 = smd 1.3 x 1.5: 1 -0.85,0; 2 0.85,0
1X04 = drill 1.016 long: 1 -3.81,0; 2 -1.27,0; 3 1.27,0; 4 3.81,0
DIODE_DO214AA = smd 2.184 x 2.083: 1 -1.854,0; 2 1.854,0
SO-08M = smd 0.6 x 2.2: 1 -1.905,-3.33; 2 -0.635,-3.33; 3 0.635,-3.33; 4 1.905,-3.33; 5 1.905,3.33; 6 0.635,3.33; 7 -0.635,3.33; 8 -1.905,3.33
LQFP64_PACKAGE = smd 1.2 x 0.3: 1 -6.1,3.75; 2 -6.1,3.25; 3 -6.1,2.75; 4 -6.1,2.25; 5 -6.1,1.75; 6 -6.1,1.25; 7 -6.1,0.75; 8 -6.1,0.25; 9 -6.1,-0.25; 10 -6.1,-0.75; 11 -6.1,-1.25; 12 -6.1,-1.75; 13 -6.1,-2.25; 14 -6.1,-2.75; 15 -6.1,-3.25; 16 -6.1,-3.75; 33 6.1,-3.75; 34 6.1,-3.25; 35 6.1,-2.75; 36 6.1,-2.25; 37 6.1,-1.75; 38 6.1,-1.25; 39 6.1,-0.75; 40 6.1,-0.25; 41 6.1,0.25; 42 6.1,0.75; 43 6.1,1.25; 44 6.1,1.75; 45 6.1,2.25; 46 6.1,2.75; 47 6.1,3.25; 48 6.1,3.75 | smd 0.3 x 1.2: 17 -3.75,-6.1; 18 -3.25,-6.1; 19 -2.75,-6.1; 20 -2.25,-6.1; 21 -1.75,-6.1; 22 -1.25,-6.1; 23 -0.75,-6.1; 24 -0.25,-6.1; 25 0.25,-6.1; 26 0.75,-6.1; 27 1.25,-6.1; 28 1.75,-6.1; 29 2.25,-6.1; 30 2.75,-6.1; 31 3.25,-6.1; 32 3.75,-6.1; 49 3.75,6.1; 50 3.25,6.1; 51 2.75,6.1; 52 2.25,6.1; 53 1.75,6.1; 54 1.25,6.1; 55 0.75,6.1; 56 0.25,6.1; 57 -0.25,6.1; 58 -0.75,6.1; 59 -1.25,6.1; 60 -1.75,6.1; 61 -2.25,6.1; 62 -2.75,6.1; 63 -3.25,6.1; 64 -3.75,6.1
1X05 = drill 1.016 long: 1 -5.08,0; 2 -2.54,0; 3 0,0; 4 2.54,0; 5 5.08,0
LPS3015 = smd 1.14 x 3.05: 1 -1.08,0; 2 1.08,0
SOT23 = smd 0.9 x 1.2: 1 -0.95,-1.2; 2 0.95,-1.2; 3 0,1.2
R2012 = smd 1.3 x 1.5: 1 -0.85,0; 2 0.85,0
DRC0010A = smd 0.36 x 0.24: 1 -1.4,1; 2 -1.4,0.5; 3 -1.4,0; 4 -1.4,-0.5; 5 -1.4,-1; 6 1.4,-1; 7 1.4,-0.5; 8 1.4,0; 9 1.4,0.5; 10 1.4,1 | smd 1.65 x 2.4: 11 0,0 | smd 0.5 x 0.5: V 0,-0.95
DRC10_2P4X1P65 = smd 0.6 x 0.24: 1 -1.4,1; 2 -1.4,0.5; 3 -1.4,0; 4 -1.4,-0.5; 5 -1.4,-1; 6 1.4,-1; 7 1.4,-0.5; 8 1.4,0; 9 1.4,0.5; 10 1.4,1 | smd 1.651 x 2.388: 11 0,0 | smd 0.203 x 0.203: V 0,-0.94
1.27_60 = drill 0.6: P$1 -0.635,18.415; P$2 0.635,18.415; P$3 -0.635,17.145; P$4 0.635,17.145; P$5 -0.635,15.875; P$6 0.635,15.875; P$7 -0.635,14.605; P$8 0.635,14.605; P$9 -0.635,13.335; P$10 0.635,13.335; P$11 -0.635,12.065; P$12 0.635,12.065; P$13 -0.635,10.795; P$14 0.635,10.795; P$15 -0.635,9.525; P$16 0.635,9.525; P$17 -0.635,8.255; P$18 0.635,8.255; P$19 -0.635,6.985; P$20 0.635,6.985; P$21 -0.635,5.715; P$22 0.635,5.715; P$23 -0.635,4.445; P$24 0.635,4.445; P$25 -0.635,3.175; P$26 0.635,3.175; P$27 -0.635,1.905; P$28 0.635,1.905; P$29 -0.635,0.635; P$30 0.635,0.635; P$31 -0.635,-0.635; P$32 0.635,-0.635; P$33 -0.635,-1.905; P$34 0.635,-1.905; P$35 -0.635,-3.175; P$36 0.635,-3.175; P$37 -0.635,-4.445; P$38 0.635,-4.445; P$39 -0.635,-5.715; P$40 0.635,-5.715; P$41 -0.635,-6.985; P$42 0.635,-6.985; P$43 -0.635,-8.255; P$44 0.635,-8.255; P$45 -0.635,-9.525; P$46 0.635,-9.525; P$47 -0.635,-10.795; P$48 0.635,-10.795; P$49 -0.635,-12.065; P$50 0.635,-12.065; P$51 -0.635,-13.335; P$52 0.635,-13.335; P$53 -0.635,-14.605; P$54 0.635,-14.605; P$55 -0.635,-15.875; P$56 0.635,-15.875; P$57 -0.635,-17.145; P$58 0.635,-17.145; P$59 -0.635,-18.415; P$60 0.635,-18.415
JST_2 = drill 1.016 long: 1 1.38,1.28; 2 3.92,1.28
MMC5883MA-B = drill 0.6 square: 1 8.89,2.54; 2 8.89,0; 3 8.89,-2.54; 4 -8.89,2.54; 5 -8.89,0; 6 -8.89,-2.54
L3GD20_SET = drill 1.1: CS 10.16,2.54; GND 10.16,10.16; INT1 10.16,7.62; INT2 10.16,5.08; SCL 2.54,7.62; SDI 2.54,5.08; SDO 2.54,2.54; VDD 2.54,10.16
NJM064M = smd 1.27 x 0.72: 1 -3.05,3.81; 2 -3.05,2.54; 3 -3.05,1.27; 4 -3.05,0; 5 -3.05,-1.27; 6 -3.05,-2.54; 7 -3.05,-3.81; 8 3.05,-3.81; 9 3.05,-2.54; 10 3.05,-1.27; 11 3.05,0; 12 3.05,1.27; 13 3.05,2.54; 14 3.05,3.81
JST_3 = drill 1.016 long: 1 2.56,2.56; 2 5.1,2.56; 3 7.64,2.56
ADR3525 = smd 0.4 x 1.2: 1 -1.405,-1.337; 2 -0.755,-1.337; 3 -0.105,-1.337; 4 0.545,-1.337; 5 0.545,2.977; 6 -0.105,2.977; 7 -0.755,2.977; 8 -1.405,2.977 | smd 1.73 x 1.78: TH -0.43,0.82
LTC4361_2 = smd 0.42 x 1.22: P$1 0,0; P$2 0.65,0; P$3 1.3,0; P$4 1.95,0; P$5 1.95,2.62; P$6 1.3,2.62; P$7 0.65,2.62; P$8 0,2.62
SO-08 = smd 0.6 x 2.2: 1 -1.815,-2.74; 2 -0.545,-2.74; 3 0.725,-2.74; 4 1.995,-2.74; 5 1.995,2.46; 6 0.725,2.46; 7 -0.545,2.46; 8 -1.815,2.46
LT6106 = smd 0.635 x 1.27: P$1 0,-0.02; P$2 0.95,-0.02; P$3 1.9,-0.02; P$4 1.9,2.6; P$5 0,2.62
TR-NPN-2SC3326 = smd 0.8 x 1.4: B 0.5,-0.5; C 1.5,2; E 2.4,-0.5
JST_1MM_10 = smd 1.2 x 1.8: P$1 0.6,0.9; P$12 12.2,0.9 | smd 0.6 x 1.55: P$2 1.9,4.775; P$3 2.9,4.775; P$4 3.9,4.775; P$5 4.9,4.775; P$6 5.9,4.775; P$7 6.9,4.775; P$8 7.9,4.775; P$9 8.9,4.775; P$10 9.9,4.775; P$11 10.9,4.775
IND_4012 = smd 0.9 x 1.3: 1 -1.9,0; 2 1.9,0
SOT23' = smd 1 x 1.4: 1 -0.95,-1.1; 2 0.95,-1.1; 3 0,1.1
DGQ10_2P18X1P72 = smd 1.411 x 0.27: 1 -2.175,1; 2 -2.175,0.5; 3 -2.175,0; 4 -2.175,-0.5; 5 -2.175,-1; 6 2.175,-1; 7 2.175,-0.5; 8 2.175,0; 9 2.175,0.5; 10 2.175,1 | smd 1.72 x 2.18: 11 0,0 | drill 0.254 pad 0.508: V -0.406,-0.406; V_1 -0.406,0.406; V_2 0.406,-0.406; V_3 0.406,0.406

### Placement (x,y rotation side)
ADC1  30.73,41.03 180 top
ADC2  21.95,70.15 0 bottom
ADC3  14.8,63.88 180 top
ADC4  35.94,16.62 0 top
C1  7.16,49.59 0 top
C2  17.51,48.99 90 top
C3  49.09,49.7 180 top
C4  54.67,46.38 90 top
C5  34.61,59.49 270 top
C6  31.53,52.67 270 top
C7  34.51,71.91 270 top
C8  34.39,65.15 270 top
C9  49.57,63.01 270 top
C10  54.25,63.88 0 top
C11  23.5,48.33 0 top
C12  21.83,59.44 0 top
C13  22.38,67.09 0 top
C14  28.22,69.22 0 top
C15  16.82,80.4 180 top
C16  11.89,80.35 180 top
C17  22.03,63.64 90 top
C18  11.75,69.2 0 top
C19  31.3,35.29 0 top
C20  31.31,32.48 0 top
C21  22.8,32.87 270 top
C22  26.57,34.88 0 top
C23  23.37,38.68 0 top
C24  26.77,32.41 0 top
C25  3.78,85.39 90 top
C26  10.01,41.27 0 top
C27  7.09,62.02 180 top
C28  15.87,41.6 270 top
C29  10.01,36.72 0 top
C30  10,39.09 0 top
C31  -112.96,-40.82 0 top  (outside the outline)
C32  -112.96,-46.97 0 top  (outside the outline)
C33  -112.96,-34.67 0 top  (outside the outline)
C34  -112.96,-53.12 0 top  (outside the outline)
C35  12.82,77.97 270 bottom
C36  10.74,73.44 270 bottom
C37  25.49,77 90 bottom
C38  22.47,77.12 90 bottom
C39  14.37,73.81 180 bottom
C40  31.19,75.19 90 bottom
C41  49.8,60.69 0 bottom
C42  45.22,64.8 270 bottom
C43  56.67,19.25 90 top
C44  6.92,50.36 0 bottom
C45  43.38,24.34 90 top
C46  59.46,19.23 90 top
C47  54.11,19.24 90 top
C48  40.65,24.38 90 top
C49  51.71,19.19 90 top
C50  4.25,24.05 0 top
C51  4.2,26.36 0 top
C52  4.23,28.72 0 top
C53  4.26,31.2 0 top
C54  -112.96,-88.5 0 top  (outside the outline)
C55  -112.96,-82.35 0 top  (outside the outline)
C56  -112.96,-102.65 0 top  (outside the outline)
C57  -112.96,-108.8 0 top  (outside the outline)
C58  -124.83,-114.95 0 top  (outside the outline)
C59  -124.83,-121.1 0 top  (outside the outline)
CAM  59.02,51.74 270 top
CR1  -109.46,-76.93 0 top  (outside the outline)
FLASH_CAM  44.91,29.2 90 top
FLASH_SENSOR  13.75,24.09 0 top
IC1  23.42,22.09 180 top
JP1  8.99,17.61 90 top
L1  -118.45,-106.76 0 top  (outside the outline)
Q1  21.76,57.77 270 bottom
Q3  52.75,69.01 180 bottom
R1  7.27,51.73 0 top
R2  15.24,49.04 270 top
R3  8.42,54.97 90 top
R4  13.06,49.11 90 top
R5  58.64,63.72 180 top
R6  45.78,55.54 0 top
R7  58.73,61.5 0 top
R8  45.52,52.93 0 top
R9  31.89,59.52 270 top
R10  34.12,52.41 90 top
R11  33.33,55.74 0 top
R12  36.26,48.97 270 top
R13  5.82,58.75 270 top
R14  10.85,49.14 270 top
R15  54.4,49.76 0 top
R16  43.94,50.31 0 top
R17  45.73,58.98 90 top
R18  39.62,51.22 180 top
R19  35.86,75.15 180 top
R20  37.72,62.92 0 top
R21  39.86,74.44 0 top
R22  42.01,62.77 0 top
R23  45.02,74.87 90 top
R24  44.97,66.73 90 top
R25  47.19,63.1 270 top
R26  54.22,61.63 180 top
R27  51.5,75.06 90 top
R28  55.72,69.29 90 top
R29  48.41,74.34 180 top
R30  54.72,74.68 180 top
R31  22.17,45.55 0 top
R32  28.09,48.3 180 top
R33  19.95,49.81 270 top
R34  25.08,59.84 90 top
R35  20.05,53.91 270 top
R36  28.41,58.93 180 top
R37  22.76,69.64 0 top
R38  29.76,66.45 180 top
R39  19.77,72.7 90 top
R40  26.44,80.23 0 top
R41  19.83,76.79 90 top
R42  31.04,80.51 180 top
R43  21.63,80.43 0 top
R44  7.96,79.41 270 top
R45  22.25,75.12 270 top
R46  7.89,75.01 90 top
R47  16.97,69.08 0 top
R48  8.08,70.94 90 top
R49  7.74,66.33 90 top
R50  59.14,58.69 180 top
R51  9.53,30.78 180 top
R52  3.66,40.48 90 top
R53  6.06,40.42 90 top
R54  5.84,35.18 90 top
R55  8.79,26.49 90 top
R56  3.2,35.27 90 top
R57  9.59,33.61 0 top
R58  15.28,77.5 90 bottom
R59  28.76,75.59 270 bottom
R60  18.88,77.16 0 bottom
R61  59.21,65.6 0 bottom
R62  59.12,61.13 0 bottom
R63  59.18,58.39 0 bottom
R64  59.13,63.25 180 bottom
R65  48.56,75.78 180 bottom
R66  10.35,58.01 270 bottom
R67  6.53,48.11 180 bottom
R68  39.8,59.27 270 bottom
R69  39.93,73.56 0 bottom
R70  50.52,57.59 270 bottom
R71  54.66,64.24 90 bottom
R72  40.92,67.79 270 bottom
R73  52.83,73.99 270 bottom
R74  44.13,75.6 0 bottom
R75  11.73,47.71 0 bottom
R76  43.75,20.71 180 top
R77  -112.96,-28.52 0 top  (outside the outline)
R78  -112.96,-65.42 0 top  (outside the outline)
R79  11.12,49.94 0 bottom
R80  14.23,53.07 90 bottom
R81  18.38,53.81 180 bottom
R82  10.72,54.06 0 bottom
R83  -112.96,-71.57 0 top  (outside the outline)
R86  -124.83,-144.03 0 top  (outside the outline)
R89  -124.83,-163.61 0 top  (outside the outline)
R92  -124.83,-183.19 0 top  (outside the outline)
SUN_SENSOR1  45.08,47.01 180 top
SUN_SENSOR2  11.88,45.17 0 top
SUN_SENSOR3  49.44,79.14 0 top
SUN_SENSOR4  20.33,83.53 0 top
U1  -112.95,-95.55 0 top  (outside the outline)
U2  5.72,5.41 0 top
U$1  32,8.54 90 top
U$2  25.24,64.85 180 bottom
U$3  56.28,33.02 90 top
U$4  37.08,32.35 90 bottom
U$5  14.32,55.15 90 top
U$6  52.05,55.47 270 top
U$7  39.78,56.48 0 top
U$8  40.01,68.89 0 top
U$9  50.84,69.21 90 top
U$10  25.33,53.71 90 top
U$11  27.83,74.87 90 top
U$12  13.84,74.92 270 top
U$13  11.22,39.89 270 top
U$14  29.87,71.03 180 bottom
U$15  52.13,64.6 270 bottom
U$16  46.62,70.04 270 bottom
U$17  17.48,51.3 180 bottom
U$18  45.5,56.04 0 bottom
U$19  16.11,58.43 270 bottom
U$20  13.48,49.52 180 bottom
U$21  54.18,86.86 180 top
U$22  45.78,16.07 90 top
U$23  28.11,84.46 90 bottom
U$24  30.5,29.66 270 top
U$25  35.68,47.54 0 bottom
U$26  -122.74,-126.39 0 top  (outside the outline)
V_REF1  LM50  [SOT23']  22.77,42.48 270 top
V_REF2  LM50  [SOT23']  8.54,85.52 0 top
V_REF3  LM50  [SOT23']  47.17,24.03 0 top
X_DRV  33.53,83.98 90 bottom
X_DRV1  -123.3,-150.72 0 top  (outside the outline)
X_DRV2  -123.3,-170.3 0 top  (outside the outline)

### Tracks (layer width: path | path; a pad name or v marks a point on that pad's centre or on a via)
2.5REF  (3 unrouted)
3V3_TOLUCA  (1 unrouted)
3V3_WHISKA  (1 unrouted)
6V6  (1 unrouted)
+3V3  (via drill 0.35)  (28 unrouted)
  Top 0.152: 43.32,81.91 43.28,81.94 U$21.P$11 43.28,80.22 SUN_SENSOR3.1 | C25.1 7.47,84.54 | C25.1 4.58,84.54 | 6.5,84.54 C25.1 | R54.2 | R51.1 10.38,31.34 | 30.36,32.59 C20.1 | 30.32,32.62 C20.1 | C17.1 22.06,62.76 22.06,61.55 21.32,60.81 ADC3.16 19.27,60.83 19.27,63.54 17.33,65.48 9.34,65.48 | C18.1 10.14,69.2 9.37,68.43 9.37,65.51 9.34,65.48 | R49.1 9.34,65.48 | 3.22,83.99 3.85,83.99 3.78,83.99 C25.1 | 7.73,84.42 7.97,84.42 | C46.1 59.44,18.4 C43.1 C47.1 54.06,18.34 C49.1 51.71,16.22 v51.74,16.22 | 46.01,22.72 V_REF3.1 44.62,22.93 | 44.62,22.93 43.94,22.93 C45.1 | R54.2 3.29,36.03 R56.2 | R54.2 8.47,36.03 C29.1 | C29.1 10.42,34.78 10.44,33.49 | C26.1 9.16,40.14 | 9.16,40.14 C30.1 C29.1 | R53.2 C26.1 | R52.2 3.72,41.27 R53.2 | 10.44,33.49 10.44,30.84 R51.1 | FLASH_SENSOR.8 11.77,27.34 R55.2 7.33,27.39 v7.32,27.34 | R51.1 10.51,30.65 | 9.27,40.25 9.16,40.14 | C26.1 9.16,42.04 9.92,42.8 15.52,42.8 C28.1 17.89,42.45 18.87,43.43 V_REF1.1 | U$3.3 U$3.2 56.29,38.15 52.22,34.83 U$4.VDD | C25.1 1.67,84.54 v1.64,84.57 | 44.6,22.91 44.62,22.93 | CAM.1 59.99,56.52 R50.1 60.6,58.9 | 30.45,35.04 30.45,35.2 C19.1 | 30.45,35.04 C20.1 | 30.46,31.94 C20.1 | C20.1 30.46,31.52 30.09,31.15 26.64,31.15 25.92,31.87 C24.1 25.72,32.61 C22.1 23.96,34.88 C21.1 | C19.1 | 30.45,35.94 30.45,35.04 | ADC1.16 v36.1,37.96 v36.11,37.95 | R51.1 v11.71,30.76 | SUN_SENSOR2.1 6.73,42.27 R53.2 | R57.2 10.44,33.49 | C25.1 7.73,84.42 | R76.1 44.63,20.68 | V_REF2.1 7.73,84.42
  Top 0.406: 7.47,84.54 V_REF2.1 | 10.9,68.64 C18.1
  Route2 0.152: v1.64,84.57 0.82,84.57 0.8,84.55 | 0.8,84.55 0.77,84.52 0.78,84.52 0.8,84.54 0.8,84.55 | v51.74,16.22 51.74,15.35 | v36.11,37.95 36.11,38.39 36.14,38.42 | v7.32,27.34 7.32,27.77 | v11.71,30.76 11.71,31.2
  Bottom 0.152: 14.27,78.82 14.11,78.82 | 14.11,78.82 13.93,78.82 13.16,78.81 12.92,78.81 C35.1 | C36.1 C39.1 14.09,75.1 14.11,78.82 | 22.42,76.14 22.27,75.74 21.83,76.18 18.98,76.18 18.85,76.31 18.85,76.34 R60.2 R58.2 15.15,78.41 14.27,78.83 | 22.42,76.14 C38.1 | 24.51,76.15 C37.1 | 24.51,76.15 22.42,76.14 | ADC2.16 26.39,73.29 | 26.39,73.29 26.39,73.36 ADC2.16 | U$14.8 27.43,68.59 27.43,72.65 27.06,73.22 ADC2.16 | 26.52,73.21 26.39,73.29 | R74.2 SUN_SENSOR3.1 46.29,77.08 48.78,77.08 R65.2 51.38,75.8 R73.1 | 24.51,76.15 24.51,71.92 24.81,71.71 25.64,71.71 ADC2.16 | U$15.P$5 U$15.P$3 | SUN_SENSOR4.1 14.14,82.17 14.11,78.82
  pour Route2: 0,88 64.01,88 64.01,0 0,0
+X_IN  (1 unrouted)
+X_X1  (via drill 0.35)  (1 unrouted)
  Top 0.152: C6.1 31.69,53.47 32.54,53.24 R10.2 35.27,53.91 U$7.6 39.96,53.27 v39.97,53.3 | v39.97,49.58 SUN_SENSOR1.5
  Bottom 0.152: v39.97,53.3 v39.97,49.58
+X_X2  (4 unrouted)
+X_Y1  (2 unrouted)
  Top 0.152: R9.2 34.58,58.67 C5.2 34.87,58.64 35.21,58.98 36.69,58.98 U$7.2 39.17,59.02 | 41.66,47.89 SUN_SENSOR1.4
+X_Y2  (3 unrouted)
  Top 0.152: 54.59,57.93 U$6.2 55.43,60.21 56.13,60.21 56.47,60.53 56.47,63.03 R5.2
+Z_IN  (via drill 0.35)  (1 unrouted)
  Top 0.152: 36.54,13.55 ADC4.5 37.2,10.99 53.52,10.99 56.52,8.2 v56.48,5.2 | v52.96,5.16 33.96,5.17 32.62,6.04 U$1.P$31
  Bottom 0.152: v56.48,5.2 53.03,5.2 v52.96,5.16
+Z_X1  (via drill 0.35)  (3 unrouted)
  Top 0.152: 54.64,79.15 54.57,79.14 SUN_SENSOR3.5 | 54.64,79.15 56.18,79.24 57.09,78.33 57.09,67.34 56.87,67.12 v55.44,67.12 | 54.61,79.17 54.64,79.15 | C10.1 53.4,61.66 R26.2 | U$9.6 53.37,66.73 v53.92,67.18 54.06,67.03
  Top 0.406: C10.1 53.4,63.74
  Bottom 0.152: 54.17,67.18 v53.92,67.18
+Z_X2  (1 unrouted)
  Top 0.152: SUN_SENSOR3.3 47.98,79.01 47.94,80.88 47.29,80.9 47.28,82.06 U$21.P$7 | C8.1 34.74,66.35 U$8.6 36.98,66.33 | 36.98,66.33 37,66.31 | 36.98,66.33 36.98,66.29 | R20.2 38.57,65.92 38.25,66.33 36.98,66.33
+Z_Y1  (via drill 0.35)
  Top 0.152: 49.48,62.25 C9.2 | U$9.2 48.42,66.03 | U$21.P$6 48.32,81.94 48.32,81.14 48.48,80.98 51.61,80.98 51.95,80.64 51.95,79.17 SUN_SENSOR3.4 v52.71,77.05 | U$9.2 49.04,67.21 49.16,67.33 49.97,67.33 51.55,68.92 v53.66,68.92 | R25.2 arc90 47.28,62.16 C9.2 | U$9.2 48.38,66.08 48.38,65.29 48.59,65.08 51.07,65.08 51.31,64.84 51.31,62.87 50.59,62.15 50.58,62.16 C9.2
  Top 0.406: U$21.P$6
  Bottom 0.152: v53.66,68.92 55.37,68.92 56.91,70.62 56.92,76.32 56.01,77 52.84,77 v52.71,77.05
+Z_Y2  (via drill 0.35)  (1 unrouted)
  Top 0.152: U$21.P$8 SUN_SENSOR3.2 46.63,79.14 44.8,77.31 43.92,77.31 42.09,79.14 41.91,79.14 v40.99,78.22 | 35.3,75.44 R19.2 33.25,73.39 33.25,71.62 33.81,71.06 C7.2 34.88,71.43 U$8.2
-X_IN  (1 unrouted)
-X_X1  (3 unrouted)
  Top 0.152: U$10.6 27.84,48.95 27.29,48.35 R32.2
-X_X2  (2 unrouted)
  Top 0.152: R2.2 15.28,48.19 C2.1 18.25,48.88 18.39,48.88 18.8,49.29 18.8,52.86 18.2,53.46 | 15.24,48.14 R2.2 | U$5.6 16.86,53.11 17.26,53.51 18.13,53.51 | R2.2 SUN_SENSOR2.3
-X_Y1  (2 unrouted)
  Top 0.152: 23.01,50.44 U$10.2 22.79,49.88 23.02,49.65 23.04,49.67 24.06,49.67 24.35,49.38 C11.2 24.35,46.88 R31.2
-X_Y2  (1 unrouted)
  Top 0.152: 11.78,51.87 U$5.2 11.37,50.95 9.27,50.95 9.24,50.97 R1.2 8.12,49.7 C1.2 8.8,49.55 9.35,48.94 SUN_SENSOR2.2
-Y_IN
  Top 0.152: U$1.P$27 30.12,5.58 28.8,3.8 11.37,3.84 9.87,5.51 9.87,10.71 11.44,12.04 33.65,11.93 34.08,12.32 ADC4.3
-Y_X1  (4 unrouted)
-Y_X2  (2 unrouted)
  Top 0.152: U$11.6 30.37,71.04 29.82,70.49 28.62,70.49 28.19,70.06 28.19,70.04 C14.1 27.34,69.19 27.34,67.07 27.96,66.45 R38.2
  Top 0.406: 27.77,69.22 C14.1
-Y_Y1  (1 unrouted)
  Top 0.152: C15.2 16.38,79.99 U$12.2 16.38,77.39 17.01,76.76 18.17,76.76 18.48,77.07 18.48,78.65 18.95,79.12 22.19,79.12 22.5,79.43 22.5,80.41 R43.2 22.87,80.82 SUN_SENSOR4.4
-Y_Y2  (2 unrouted)
  Top 0.152: C13.2 23.28,69.22 R37.2 23.74,69.64 24.91,69.59 25.29,70.1 U$11.2
-Z_IN
  Top 0.152: ADC4.4 36.03,10.57 53.27,10.61 54.15,9.59 54.11,2.39 53.24,1.88 49.77,1.74 | 50.2,1.74 49.77,1.74 | 49.77,1.74 32.62,1.81 31.39,3.04 U$1.P$29
ADC1_CS  (2 unrouted)
ADC2_CS  (2 unrouted)
  Top 0.152: ADC3.10 11.61,60.83 11.61,63.05 10.61,64.05 6.57,64.05 6.07,64.54 6.07,66.48 6.77,67.18 R49.2 | R76.2 41.98,20.71 40.45,22.04 39.75,22.04 39.14,21.43 ADC4.10
CRT-18F
  Bottom 0.152: U$18.P$1 47.87,58.4 R70.1
CS_GYRO  (2 unrouted)
FAULT_X  (1 unrouted)
FAULT_Y  (1 unrouted)
FAULT_Z  (1 unrouted)
FLASH1_CS  (1 unrouted)
  Top 0.152: FLASH_SENSOR.1 11.89,20.71 | 11.89,20.71 12.02,20.59 | R54.1 5.84,33.45 7.72,31.57 7.72,29.9 8.38,29.25 13.12,29.25 13.72,28.65 13.72,26.19 11.89,24.37 11.89,20.71
FLASH2_CS  (2 unrouted)
GND  (via drill 0.35)  (79 unrouted)
  Top 0.152: 48.41,30.94 FLASH_CAM.4 | 8.4,86.48 V_REF2.3 | C25.2 4.16,86.62 V_REF2.3 | 5.05,26.28 5.05,24.1 C50.2 6.65,22.5 6.65,19.17 8.21,17.61 JP1.3 14.73,17.61 15.65,18.54 15.65,18.8 | 5.05,26.28 C51.2 | 5.05,26.28 5.08,26.31 C52.2 5.11,28.75 C53.2 | 17.27,18.89 IC1.47 17.28,18.8 15.65,18.8 | 15.65,18.8 FLASH_SENSOR.4 | 40.43,19.74 ADC4.9 v40.39,21.08 | C48.2 43.34,25.23 C45.2 47.11,25.19 V_REF3.3 49.03,25.13 49.62,24.54 49.62,22.13 C49.2 54.06,20.04 C47.2 C43.2 59.44,20.1 C46.2 | CAM.4 59.02,47.19 U$3.1 47.84,41.91 U$4.GND | V_REF2.3 11.36,86.62 v11.38,86.6 | C21.2 22.83,29.91 22.24,29.44 20.69,29.45 20.19,28.99 IC1.31 | C20.2 C19.2 32.63,35.77 ADC1.14 | U$10.3 24.58,49.66 25.48,49.66 | 25.48,49.66 26.3,49.66 U$10.5 | U$5.12 13.56,57.11 14.9,57.15 U$5.10 15.59,59.07 16.66,59.41 ADC3.14 | C27.2 7.13,60.81 ADC3.9 | U$12.10 12.54,69.26 | 25.48,49.66 25.48,43.35 V_REF1.3 23.87,39.03 C23.2 24.94,37.96 ADC1.9 26.29,36.83 27.44,35.67 C22.2 27.4,32.95 C24.2 28.94,32.41 v28.97,32.44 | U$1.P$59 51.93,7.91 v52.01,7.95 | C26.2 C30.2 C29.2 11.9,35.33 11.85,33.17 U$13.3 | U$10.10 26.58,55.99 26.27,55.73 24.35,55.73 24.04,55.97 U$10.12 | U$6.5 51.61,57.47 52.75,57.47 U$6.3 | ADC4.14 34.06,21.36 v34.16,21.51 | 39.96,70.16 U$8.3 v35.81,69.52 | 39.96,70.16 U$8.12 | U$8.5 39.96,67.62 | 39.96,67.62 U$8.10 | 39.96,70.16 39.96,67.62 | U$11.5 28.36,70.83 27.25,70.83 U$11.3 | U$5.3 13.35,51.11 15.2,51.12 U$5.5 | U$12.5 12.8,76.89 14.76,76.89 U$12.3
  Top 0.406: 12.54,69.26 C18.2
  Route15 0.152: v11.38,86.6 11.71,86.6 11.75,86.64 12.45,86.64 12.52,86.57 | v52.01,7.95 52.51,7.91 52.5,7.91 52.49,7.9 | v28.97,32.44 28.97,33.04 29.01,33.04 29.04,33.07 | v34.16,21.51 34.13,21.92 | v40.39,21.08 40.39,21.59 | v35.81,69.52 35.44,69.29 35.44,69.34 35.49,69.26
  Bottom 0.152: 27.47,77.69 27.51,75.11 27.74,74.77 R59.2 28.77,73.56 29.09,73.29 U$14.2 | 27.47,77.69 27.96,77.93 30.79,77.9 31.2,77.31 C40.2 | 27.47,77.69 25.98,77.71 C37.2 C38.2 | ADC2.14 23.22,72.59 23.22,72.08 23.04,71.9 18.32,71.9 18.14,72.08 18.14,72.59 ADC2.9 16.93,73.81 C39.2 15.25,72.36 14.84,71.87 12.06,71.87 C36.2 | U$18.P$2 44.6,55.09 45.33,54.83 50.27,54.93 50.55,55.35 R70.2 | C41.2 48.97,60.74 | 48.97,60.74 49.47,61.77 51.76,61.77 U$15.P$4 53.06,62.66 53.45,63.37 R71.1 | C42.2 46.26,63.97 47.78,60.69 48.97,60.74
  pour Route15: 0,88 64,88 64,0 0,0.01
GND_SOLAR  (3 unrouted)
  Bottom 0.152: 54,83.84 55.37,83.84 55.77,83.84
I2C1_SCL  (1 unrouted)
I2C1_SDA  (1 unrouted)
MD_VOL_DEF  (1 unrouted)
MD_VOL_REF  (1 unrouted)
N$1  (2 unrouted)
  Top 0.152: R8.1 44.67,55.28 R6.1 45.26,55.54 44.91,55.89
N$2  (1 unrouted)
  Top 0.152: U$6.14 55.86,51.54 55.25,50.93 R15.2
N$3  (1 unrouted)
  Top 0.152: 33.91,44.77 ADC1.2 33.91,44.72 34.67,45.48 38.78,45.48 39.78,44.48 43.21,44.48 43.77,45.04 43.77,49.63 R16.1
N$4  (2 unrouted)
N$5
  Top 0.152: U$6.9 49.51,53.53 48.97,54.07 47.51,54.07 R8.2 46.34,52.9 46.34,50.64 46.01,50.31 R16.2
N$6  (1 unrouted)
  Top 0.152: R35.2 19.44,53.06 18.69,53.81 18.69,55.72 19.76,56.79 21.49,56.79 U$10.14
N$7
  Top 0.152: R36.1 29.26,56.88 U$10.8 29.14,51.99 30.47,51.1 30.47,47.35 29.81,46.69 27.23,46.7 26.29,45.76 ADC1.8
N$8  (1 unrouted)
  Top 0.152: R13.2 6.12,58.2 U$5.14
N$9  (1 unrouted)
  Top 0.152: U$8.14 43.06,75.19 43.62,75.75 44.99,75.75 R23.2
N$10
  Top 0.152: U$5.7 18.13,50.46 C2.2 17.46,49.89 R2.1 14.42,49.07 14.39,49.07 14.26,48.94 14.26,48.91 13.61,48.26 R4.1
N$11  (1 unrouted)
  Top 0.152: R14.2 R4.2 13.59,49.96
N$12
  Top 0.152: 36.96,63.01 R20.1 | 36.87,64.21 36.87,64.99 U$8.7 | C8.2 36.78,64.3 36.87,64.21 | R20.1 36.87,64.21 | R20.1 37.65,61.56 40.68,61.58 R22.1
N$13
  Top 0.152: R1.1 6.42,49.7 C1.1 5.18,50.72 5.18,53.33 5.97,54.12 R3.1 U$5.1
N$14
  Top 0.152: R13.1 9.59,59.6 10.04,59.15 11.5,59.15 11.78,58.87 U$5.13 11.78,57.4 11.44,57.06 9.66,57.06 R3.2
N$15  (1 unrouted)
N$16  (2 unrouted)
  Top 0.152: 59.47,63.74 R5.1 | U$6.1 57.8,61.39 R7.1 58.06,61.74 59.38,63.56
N$17
  Top 0.152: U$6.13 54.59,52.32 | 54.59,52.32 54.59,52.18 53.55,51.14 R15.1 | 60.05,60.96 59.8,61.25 R7.2 58.7,60.11 57.61,60.11 56.54,58.4 56.54,56.04 54.63,54.03 54.59,52.32
N$21
  Top 0.152: R12.1 36.26,49.89 | 36.26,49.89 36.26,51.53 | 36.26,51.53 36.26,52.2 U$7.7 | 34.37,51.56 R10.1 35.79,49.89 36.26,49.89 | 34.37,51.56 36.23,51.56 36.26,51.53 | C6.2 34.11,51.82 34.37,51.56
N$22  (1 unrouted)
  Top 0.152: R12.2 37.12,48.12 37.5,48.5 37.5,50.6 38.12,51.22 R18.2
N$23  (1 unrouted)
  Top 0.152: U$7.1 34.66,60.29 C5.1 34.58,60.37 R9.1
N$24  (1 unrouted)
  Top 0.152: U$7.13 43.95,59.02 44.84,58.13 R17.1
N$27  (1 unrouted)
  Top 0.152: V_REF1.2 22.52,40.68 C23.1
N$28  (2 unrouted)
N$29  (1 unrouted)
  Top 0.152: C12.2 23.13,58.99 R34.1 | U$10.7 29.14,49.38 R32.1
N$30  (1 unrouted)
  Top 0.152: U$7.14 45.27,60.29 R17.2
N$31  (1 unrouted)
  Top 0.152: R22.2 42.86,63.72 41.99,64.59 41.99,66.02 42.37,66.4 42.42,66.35 U$8.9
N$32
  Top 0.152: 36.96,74.9 36.77,75.09 36.71,75.09 R19.1 | 36.96,74.9 U$8.1 | C7.1 36.9,72.76 | 36.96,74.9 37.42,74.44 R21.1
  Top 0.406: 36.71,72.95 U$8.1 36.9,72.76
N$33
  Top 0.152: R21.2 41.87,73.28 41.87,71.75 42.24,71.38 43.01,71.38 U$8.13 43.97,71.44 45.02,72.49 R23.1
N$36  (1 unrouted)
  Top 0.152: R28.1 54.61,68.42 U$9.7 | C10.2 55.1,61.66 R26.1
N$37
  Top 0.152: 54.06,74.49 R30.2 53.98,74.56 53.98,72.26 | R28.2 54.54,71.32 54.16,71.32 53.98,71.5 53.98,72.26 | U$9.9 53.98,72.26
  Top 0.406: 55.27,70.14 R28.2
N$38  (1 unrouted)
  Top 0.152: U$9.1 47.19,66 R25.1 49.48,63.95 C9.1
  Top 0.406: 49.33,63.86 C9.1
N$39
  Top 0.152: U$9.13 48.3,73.17 R29.1 49.95,75.92 R27.2
N$40  (2 unrouted)
N$41  (2 unrouted)
N$42  (1 unrouted)
  Top 0.152: U$9.14 47.03,73.81 R29.2 43.92,70.7
N$43  (1 unrouted)
  Top 0.152: R30.1 55.57,72.24 U$9.8
N$45  (1 unrouted)
  Top 0.152: 44.43,65.57 44.66,65.57 R24.1 44.17,65.08 U$8.8
N$46
  Top 0.152: U$10.9 27.87,56.8 27.85,56.82 27.85,58.64 R36.2 27.54,58.95 27.54,60.37 27.22,60.69 R34.2
N$47
  Top 0.152: R31.1 C11.1 21.71,48.34 21.51,48.59 U$10.1 R33.1
N$48  (1 unrouted)
  Top 0.152: U$10.13 22.79,56.53 20.99,54.73 20.08,54.73 R35.1
N$52  (via drill 0.35)  (1 unrouted)
  Top 0.152: C27.1 8.72,62.8 v11,62.8 | v15.6,62.99 17.17,62.99 18.01,62.15 17.98,62.12 ADC3.15
  Bottom 0.152: v11,62.8 11.19,62.99 v15.6,62.99
N$53  (1 unrouted)
  Top 0.152: R41.2 20.11,77.92 U$11.14
N$54  (1 unrouted)
  Top 0.152: R42.1 31.89,78.17 U$11.8
  Top 0.406: R42.1 31.64,80.26
N$55  (1 unrouted)
  Top 0.152: U$11.7 32.27,71.82 32.95,72.5 32.95,73.52 33.51,74.08 33.51,80.52 33.54,81.26 32.8,82.17 | 32.83,82.17 32.8,82.17 | 32.8,82.17 26.75,82.17 25.68,81.37 R40.1 | C14.2 30.21,69.29 30.62,68.83 R38.1
N$56
  Top 0.152: 30.37,80.33 U$11.9 | 27.57,80.51 R42.2
  Top 0.406: R40.2 27.57,80.51 | R42.2 30.37,80.33
N$57
  Top 0.152: R37.1 21.91,69.71 R39.1 | C13.1 21.54,69.23 R37.1 | R37.1 21.88,71.24 22.44,71.8 U$11.1
N$58
  Top 0.152: R39.2 19.83,73.61 R41.1 20.75,75.94 21.05,76.24 21.05,77.05 21.37,77.37 23.25,77.37 23.68,76.94 24.94,76.94 25.26,77.26 25.26,77.89 U$11.13
N$60
  Top 0.152: ADC4.15 32.77,22.47 34.03,23.48 C48.1 40.65,22.28 41.23,21.86 47.87,21.83 48.15,22.08 V_REF3.2
N$61
  Top 0.152: 8.03,74.02 R46.1 9.53,74.16 9.99,74.62 9.99,77.14 | R44.1 10.95,80.26 C16.2 9.71,81.68 6.99,81.68 6.7,81.39 6.7,77.52 7.05,77.17 9.96,77.17 9.99,77.14 | 9.99,77.14 9.99,77.93 U$12.7
  Top 0.406: 7.8,74.07 R46.1
N$62
  Top 0.152: U$12.9 11.3,72.14 10.57,72.87 9.16,72.87 R48.2 7.55,71.8 6.75,72.6 6.75,75.46 7.15,75.86 R46.2
N$63  (1 unrouted)
  Top 0.152: U$12.1 17.67,77.99 C15.1 20.75,80.4 R43.1
N$64  (1 unrouted)
  Top 0.152: U$12.13 16.38,69.34
  Top 0.406: 16.38,69.34 R47.1
N$65  (2 unrouted)
N$66  (2 unrouted)
N$67  (1 unrouted)
  Top 0.152: U$12.14 17.65,69.25
  Top 0.406: 17.65,69.25 R47.2
N$68  (1 unrouted)
  Top 0.152: 9.86,71.87 U$12.8 10.03,70.96 9.16,70.09 R48.1 8.26,70.09 | 8.28,70.09 8.26,70.09 | 8.26,70.09 8.17,70.18
N$69  (1 unrouted)
  Bottom 0.152: U$16.7 U$16.8 44.94,72.39 R74.1 R65.1
N$70  (1 unrouted)
N$71  (1 unrouted)
N$72  (1 unrouted)
  Bottom 0.152: Q3.1 51.01,70.22 50.7,70.23 49.5,70.55 U$16.2 48.33,70.5
N$73  (1 unrouted)
N$74
  Top 0.152: FLASH_SENSOR.7 13.11,28.67 12.61,28.95 7.73,28.95 6.93,29.65 6.93,31.97 5.53,33.38 2.41,33.38 2.15,33.64 2.15,36.9 3.66,38.41 R52.1
N$75  (2 unrouted)
  Bottom 0.152: U$18.P$5 44.23,60.16 R68.1 | C42.1 46.48,65.65 | 46.48,65.65 50.45,65.65 51.36,63.95 U$15.P$2 | R72.1 40.93,72.94 R69.1 | U$16.1 46.97,71.81 46.44,70.26 46.48,65.65
N$78  (1 unrouted)
N$80  (1 unrouted)
N$81  (1 unrouted)
N$86  (2 unrouted)
N$87  (1 unrouted)
N$91
  Bottom 0.152: U$15.P$1 R71.2
N$92  (2 unrouted)
  Bottom 0.152: R68.2 40.3,58.65 U$18.P$4 44.12,57.74 45.91,57.72 47.9,59.71 49.7,59.71 49.83,59.84 49.83,59.87 C41.1
N$93  (1 unrouted)
N$94
  Bottom 0.152: R72.2 43.34,66.94 44.18,67.33 44.16,67.95 | 44.16,67.95 U$16.5 | 44.16,67.95 44.16,69.28 U$16.6
N$95
  Bottom 0.152: U$16.4 50.23,67.8 Q3.3 R73.2
N$96  (4 unrouted)
N$97  (2 unrouted)
N$99  (2 unrouted)
N$100  (2 unrouted)
N$102  (2 unrouted)
N$103  (2 unrouted)
N$113  (1 unrouted)
N$118  (1 unrouted)
NRST_AODS  (2 unrouted)
RESET_AODS  (1 unrouted)
RX_CAMERA  (2 unrouted)
RX_MAIN_AODS  (2 unrouted)
RX_SUB_AODS  (2 unrouted)
RX_TERMINAL  (1 unrouted)
SPI1_MISO  (6 unrouted)
SPI1_MOSI  (6 unrouted)
SPI1_SCK  (6 unrouted)
SWCLK_AODS  (1 unrouted)
  Top 0.152: IC1.49 10.76,16.01 JP1.2
SWDIO_AODS  (2 unrouted)
THERMAL  (1 unrouted)
TOLUCA_X_A  (1 unrouted)
TOLUCA_X_A_IN  (1 unrouted)
TOLUCA_X_B  (1 unrouted)
TOLUCA_X_B_IN  (1 unrouted)
TOLUCA_Y_A  (1 unrouted)
TOLUCA_Y_A_IN  (1 unrouted)
TOLUCA_Y_B  (1 unrouted)
TOLUCA_Y_B_IN  (1 unrouted)
TOLUCA_Z_A  (1 unrouted)
TOLUCA_Z_A_IN  (1 unrouted)
TOLUCA_Z_B  (1 unrouted)
TOLUCA_Z_B_IN  (1 unrouted)
TX_CAMERA  (2 unrouted)
TX_MAIN_AODS  (2 unrouted)
TX_SUB_AODS  (2 unrouted)
TX_TERMINAL  (1 unrouted)
V+  (via drill 0.35)  (11 unrouted)
  Top 0.152: U$6.4 52.05,64.58 50.84,65.79 U$9.4 | U$8.4 33.67,68.89 v32.82,68.04
  Top 0.406: 36.96,68.81 U$8.4
  Bottom 0.152: v32.82,68.04 32.82,62.66
V-  (via drill 0.35)  (11 unrouted)
  Top 0.152: U$6.11 52.05,53.83 | 52.05,53.83 52.03,53.85 | 52.05,53.83 v52.05,53.66 | v51.94,55.25 51.94,55.52 50.84,56.62 50.55,56.62 50.52,56.59 44.15,56.59 44.05,56.49 U$7.11
  Bottom 0.152: v52.05,53.66 52.05,55.14 v51.94,55.25
VCC  (10 unrouted)
VCC_STM_AODS  (via drill 0.35)  (11 unrouted)
  Top 0.152: 3.46,24.11 C50.1 | IC1.48 17.36,16.8 v17.36,16.72 | 3.38,28.57 C52.1 3.41,28.75 C53.1 3.41,28.6 3.38,28.57 | 3.38,28.57 3.38,26.39 C51.1 3.35,24.1 C50.1 | C50.1 3.4,18.12 JP1.1 9.07,12.53 15.9,12.6 15.99,12.6 v17.36,15.06
  Bottom 0.152: v17.36,16.72 v17.36,15.06
WHISKA_SPI_CLK  (1 unrouted)
WHISKA_SPI_CS
  Bottom 0.152: R58.1 15.88,76.05 16.57,75.23 18.01,75.19 ADC2.10
WHISKA_SPI_IN  (1 unrouted)
WHISKA_SPI_OUT  (1 unrouted)
WHISKA_SW  (1 unrouted)